# Altium project 211105 Precharge Controller R4b.PrjPcb
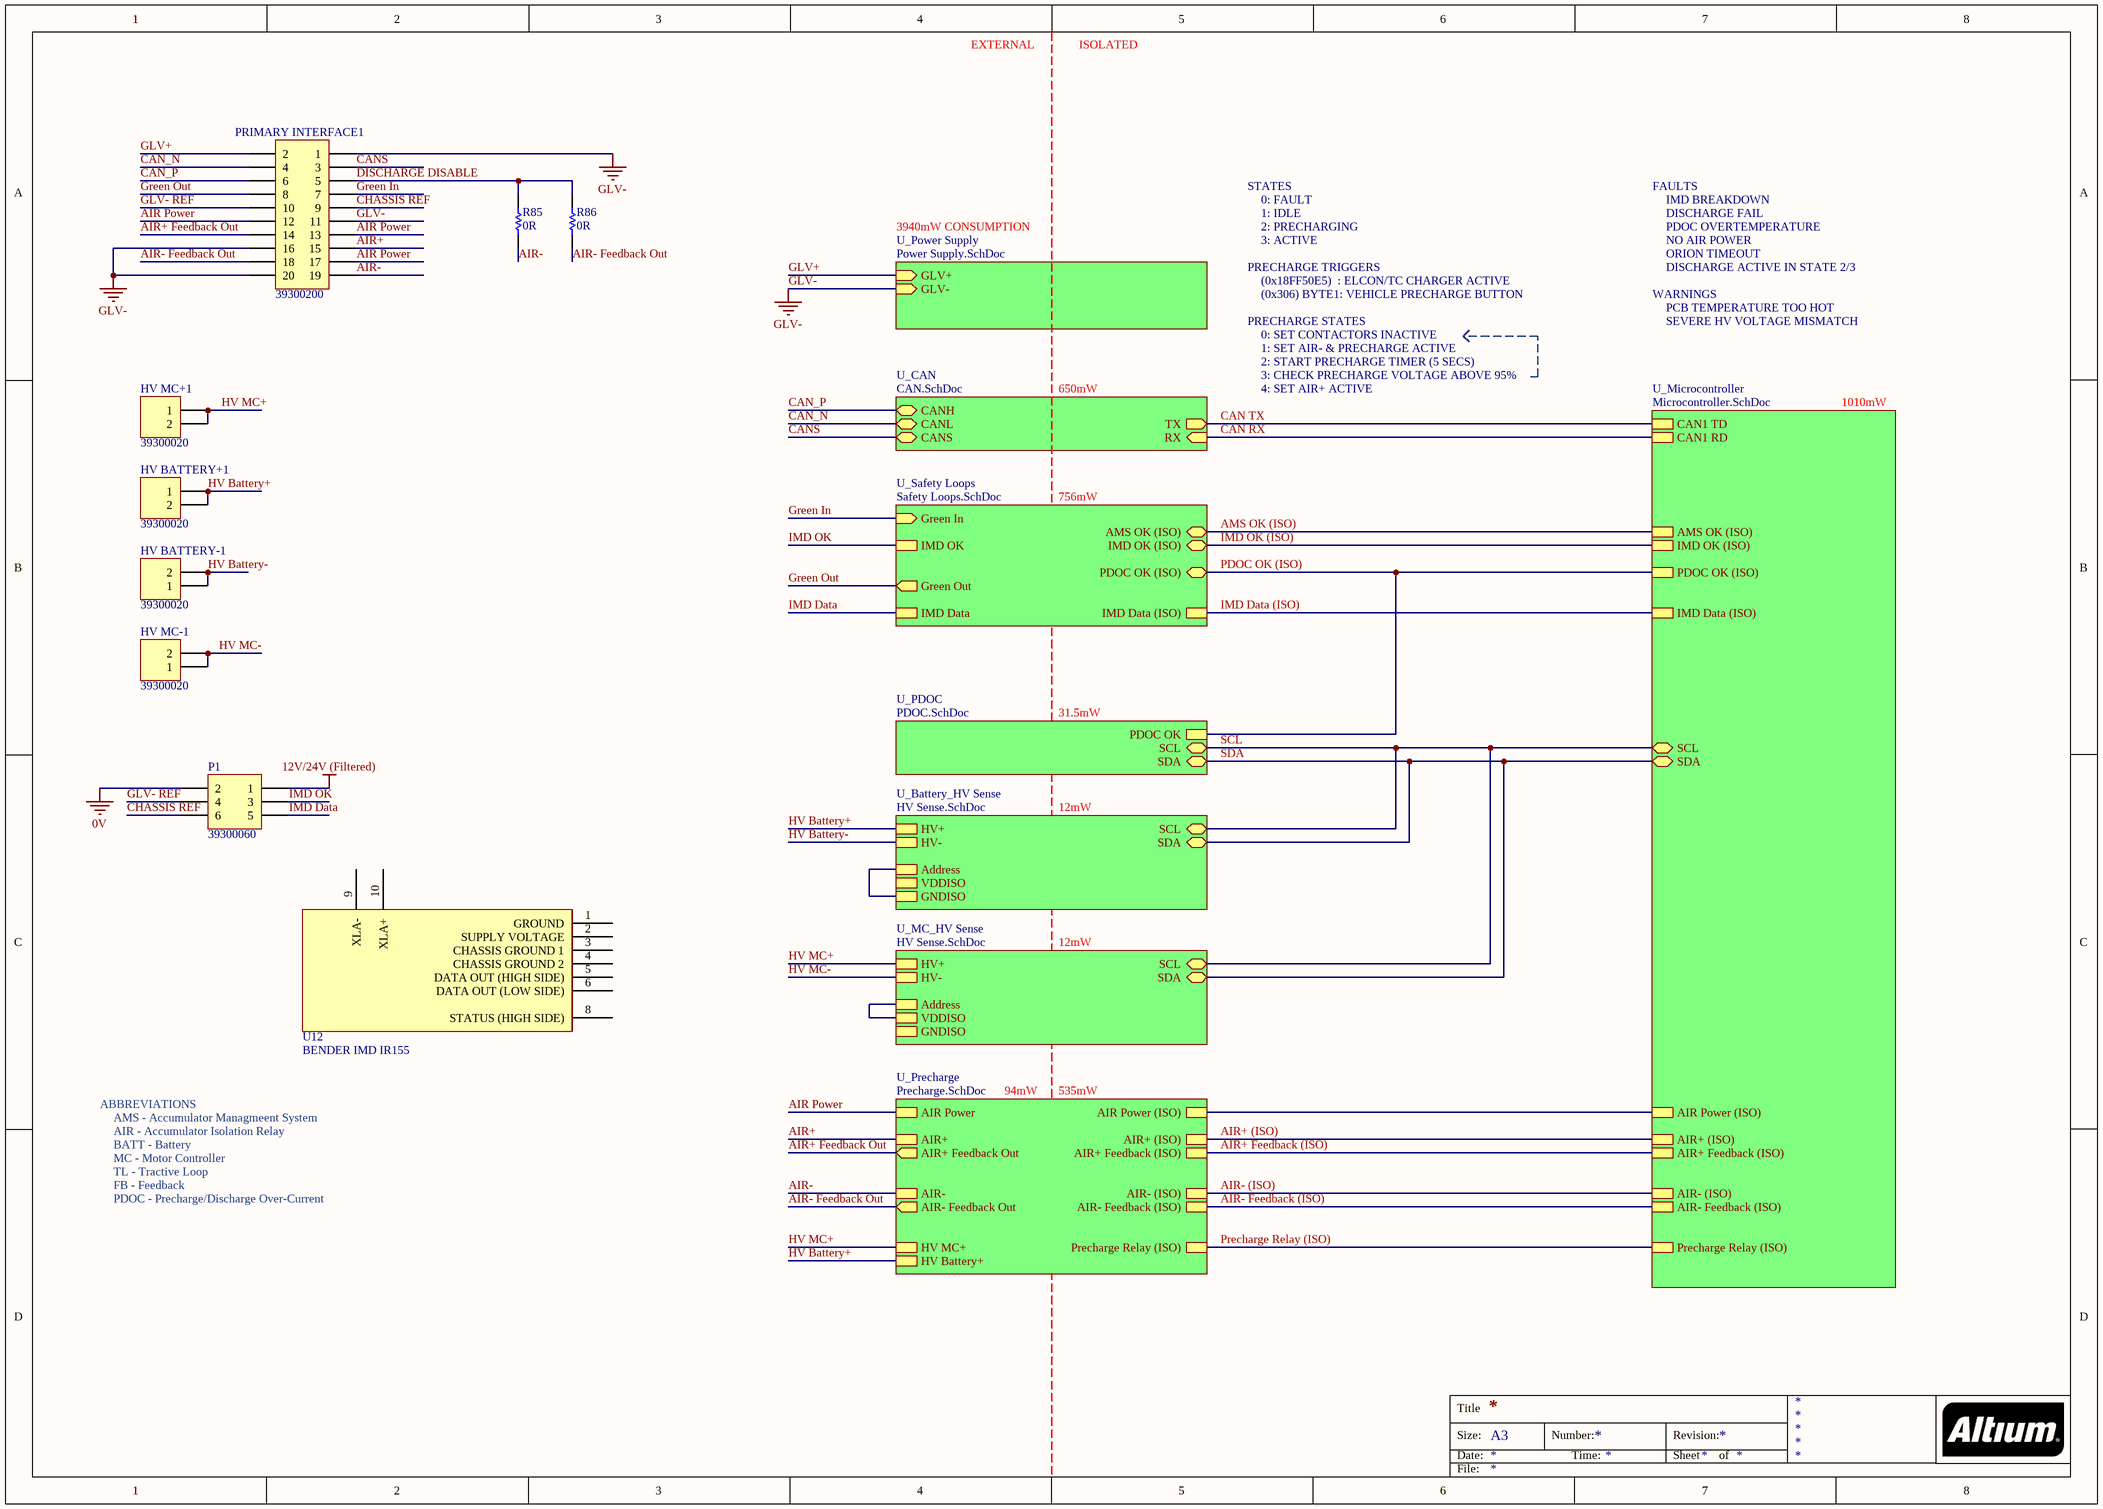
[diagram p0: Top Level.SchDoc]
6 sheets, 216 parts. Net scope: hierarchical (ports join the sheet entries above them; power ports are global).
Board file: Copy of 211105 PCB.PcbDoc
Sheets:
  Top Level.SchDoc
    U_CAN = CAN.SchDoc
    U_Power Supply = Power Supply.SchDoc
    U_Precharge = Precharge.SchDoc
    U_Microcontroller = Microcontroller.SchDoc
    U_Safety Loops = Safety Loops.SchDoc

## Sheet Top Level.SchDoc
size A3

### Parts
HV_BATTERY+1  39300020  [39300020]
HV_BATTERY-1  39300020  [39300020]
HV_MC+1  39300020  [39300020]
HV_MC-1  39300020  [39300020]
P1  39300060  [39300060]
PRIMARY_INTERFACE1  39300200  [39300200]
R85  0R  [0805]
R86  0R  [0805]
U12  BENDER IMD IR155  [BENDER IMD IR155]

### Sub-sheets
U_Battery_HV Sense = HV Sense.SchDoc (file not in this document): HV+, HV-, SCL (bidir), SDA (bidir), Address, VDDISO, GNDISO
U_CAN = CAN.SchDoc: CANH (bidir), CANL (bidir), CANS (bidir), RX (in), TX (out)
U_MC_HV Sense = HV Sense.SchDoc (file not in this document): HV+, HV-, SCL (bidir), SDA (bidir), Address, VDDISO, GNDISO
U_Microcontroller = Microcontroller.SchDoc: AIR- Feedback (ISO), AIR+ Feedback (ISO), AIR- (ISO), Precharge Relay (ISO), AIR+ (ISO), CAN1 TD, CAN1 RD, AIR Power (ISO), IMD OK (ISO), PDOC OK (ISO), AMS OK (ISO), IMD Data (ISO), SCL (bidir), SDA (bidir)
U_PDOC = PDOC.SchDoc (file not in this document): PDOC OK, SCL (bidir), SDA (bidir)
U_Power Supply = Power Supply.SchDoc: GLV+ (in), GLV- (in)
U_Precharge = Precharge.SchDoc: AIR Power, AIR- (ISO), AIR- Feedback Out (out), AIR- Feedback (ISO), AIR-, AIR+, AIR+ Feedback Out (out), AIR+ (ISO), AIR+ Feedback (ISO), Precharge Relay (ISO), HV MC+, HV Battery+, AIR Power (ISO)
U_Safety Loops = Safety Loops.SchDoc: IMD OK (ISO) (bidir), AMS OK (ISO) (bidir), PDOC OK (ISO) (bidir), Green In (in), IMD OK, Green Out (out), IMD Data, IMD Data (ISO)

### Nets
0V: P1.2
12V/24V (Filtered): P1.1
AIR Power: PRIMARY_INTERFACE1.12 PRIMARY_INTERFACE1.13 PRIMARY_INTERFACE1.17 ; sheet U_Precharge/AIR Power
GLV-: PRIMARY_INTERFACE1.1 PRIMARY_INTERFACE1.11 PRIMARY_INTERFACE1.16 PRIMARY_INTERFACE1.20 ; sheet U_Power Supply/GLV-
AIR+: PRIMARY_INTERFACE1.15 ; sheet U_Precharge/AIR+
AIR+ (ISO): sheet U_Precharge/AIR+ (ISO), sheet U_Microcontroller/AIR+ (ISO)
AIR+ Feedback (ISO): sheet U_Precharge/AIR+ Feedback (ISO), sheet U_Microcontroller/AIR+ Feedback (ISO)
AIR+ Feedback Out: PRIMARY_INTERFACE1.14 ; sheet U_Precharge/AIR+ Feedback Out
AIR-: PRIMARY_INTERFACE1.19 R85.1 ; sheet U_Precharge/AIR-
AIR- (ISO): sheet U_Precharge/AIR- (ISO), sheet U_Microcontroller/AIR- (ISO)
AIR- Feedback (ISO): sheet U_Precharge/AIR- Feedback (ISO), sheet U_Microcontroller/AIR- Feedback (ISO)
AIR- Feedback Out: PRIMARY_INTERFACE1.18 R86.1 ; sheet U_Precharge/AIR- Feedback Out
AMS OK (ISO): sheet U_Microcontroller/AMS OK (ISO), sheet U_Safety Loops/AMS OK (ISO)
CAN RX: sheet U_CAN/RX, sheet U_Microcontroller/CAN1 RD
CAN TX: sheet U_CAN/TX, sheet U_Microcontroller/CAN1 TD
CAN_N: PRIMARY_INTERFACE1.4 ; sheet U_CAN/CANL
CAN_P: PRIMARY_INTERFACE1.6 ; sheet U_CAN/CANH
CANS: PRIMARY_INTERFACE1.3 ; sheet U_CAN/CANS
CHASSIS REF: P1.6 PRIMARY_INTERFACE1.9
DISCHARGE DISABLE: PRIMARY_INTERFACE1.5 R85.2 R86.2
GLV+: PRIMARY_INTERFACE1.2 ; sheet U_Power Supply/GLV+
GLV- REF: P1.4 PRIMARY_INTERFACE1.10
Green In: PRIMARY_INTERFACE1.7 ; sheet U_Safety Loops/Green In
Green Out: PRIMARY_INTERFACE1.8 ; sheet U_Safety Loops/Green Out
HV Battery+: HV_BATTERY+1.1 HV_BATTERY+1.2 ; sheet U_Precharge/HV Battery+, sheet U_Battery_HV Sense/HV+
HV Battery-: HV_BATTERY-1.1 HV_BATTERY-1.2 ; sheet U_Battery_HV Sense/HV-
HV MC+: HV_MC+1.1 HV_MC+1.2 ; sheet U_Precharge/HV MC+, sheet U_MC_HV Sense/HV+
HV MC-: HV_MC-1.1 HV_MC-1.2 ; sheet U_MC_HV Sense/HV-
IMD Data: P1.5 ; sheet U_Safety Loops/IMD Data
IMD Data (ISO): sheet U_Microcontroller/IMD Data (ISO), sheet U_Safety Loops/IMD Data (ISO)
IMD OK: P1.3 ; sheet U_Safety Loops/IMD OK
IMD OK (ISO): sheet U_Microcontroller/IMD OK (ISO), sheet U_Safety Loops/IMD OK (ISO)
PDOC OK (ISO): sheet U_Microcontroller/PDOC OK (ISO), sheet U_Safety Loops/PDOC OK (ISO), sheet U_PDOC/PDOC OK
Precharge Relay (ISO): sheet U_Precharge/Precharge Relay (ISO), sheet U_Microcontroller/Precharge Relay (ISO)
SCL: sheet U_Microcontroller/SCL, sheet U_Battery_HV Sense/SCL, sheet U_MC_HV Sense/SCL, sheet U_PDOC/SCL
SDA: sheet U_Microcontroller/SDA, sheet U_Battery_HV Sense/SDA, sheet U_MC_HV Sense/SDA, sheet U_PDOC/SDA
NetR5_1: sheet U_Precharge/AIR Power (ISO), sheet U_Microcontroller/AIR Power (ISO)
(unnamed): sheet U_Battery_HV Sense/Address, sheet U_Battery_HV Sense/GNDISO
(unnamed): sheet U_MC_HV Sense/Address, sheet U_MC_HV Sense/VDDISO

Not connected (* = marked no-connect by the designer): U12 1(GROUND) 2(SUPPLY_VOLTAGE) 3(CHASSIS_GROUND_1) 4(CHASSIS_GROUND_2) 5(DATA_OUT_(HIGH_SIDE)) 6(DATA_OUT_(LOW_SIDE)) 8(STATUS_(HIGH_SIDE)) 9(XLA-) 10(XLA+)

### Notes on the sheet
- EXTERNAL
- ISOLATED
- 3940mW CONSUMPTION
- STATES
- 0: FAULT
- 1: IDLE
- 2: PRECHARGING
- 3: ACTIVE
- FAULTS
- IMD BREAKDOWN
- DISCHARGE FAIL
- PDOC OVERTEMPERATURE
- NO AIR POWER
- PRECHARGE TRIGGERS
- (0x18FF50E5)  : ELCON/TC CHARGER ACTIVE
- (0x306) BYTE1: VEHICLE PRECHARGE BUTTON
- WARNINGS
- PCB TEMPERATURE TOO HOT
- ORION TIMEOUT
- DISCHARGE ACTIVE IN STATE 2/3
- PRECHARGE STATES
- 1: SET AIR- & PRECHARGE ACTIVE
- 2: START PRECHARGE TIMER (5 SECS)
- 3: CHECK PRECHARGE VOLTAGE ABOVE 95%
- 0: SET CONTACTORS INACTIVE
- SEVERE HV VOLTAGE MISMATCH
- 650mW
- 4: SET AIR+ ACTIVE
- 1010mW
- 756mW
- 31.5mW
- 12mW
- ABBREVIATIONS
- AMS - Accumulator Managmeent System
- 94mW
- 535mW
- TL - Tractive Loop
- FB - Feedback
- BATT - Battery
- MC - Motor Controller
- AIR - Accumulator Isolation Relay
- PDOC - Precharge/Discharge Over-Current
- Title
- Size:
- Date:
- A3
- Number:
- Time:
- Revision:
- Sheet
- of
- File:

### Library data of the parts
HV_BATTERY+1 HV_BATTERY-1 HV_MC+1 HV_MC-1 = 39300020: Pitch: 4.2mm; Row Spacing: 5.5mm; Angle: 90; Flange: No; Contact: Tin; Part Number: 39300020; Positions: 2; Digikey Part Number: WM21351-ND
P1 = 39300060: Pitch: 4.2mm; Row Spacing: 5.5mm; Angle: 90; Flange: No; Contact: Tin; Part Number: 39300060; Positions: 6; Digikey Part Number: WM21353-ND
PRIMARY_INTERFACE1 = 39300200: Pitch: 4.2mm; Row Spacing: 5.5mm; Angle: 90; Flange: No; Contact: Tin; Part Number: 39300200; Positions: 20; Digikey Part Number: WM21360-ND
R85 R86 = RC0805FR070RL: Manufacturer: YAGEO; Tolerance: 0.01; Rated Voltage: 0.125W; Part Number: RC0805FR070RL; Value: 0R; Material: FR-07; Digikey Part Number: 311-0.0CRCT-ND
U12 = BENDER IMD IR155: Insulation monitoring device (IMD) for unearthed DC drive systems (IT systems) in electric vehicles.; Part Number: BENDER IMD IR155; Manufacturer: Bender; Link: https://www.bender.de/en/products/insulation-monitoring/isometer_ir155-3203ir155-3204

## Sheet CAN.SchDoc
size A4
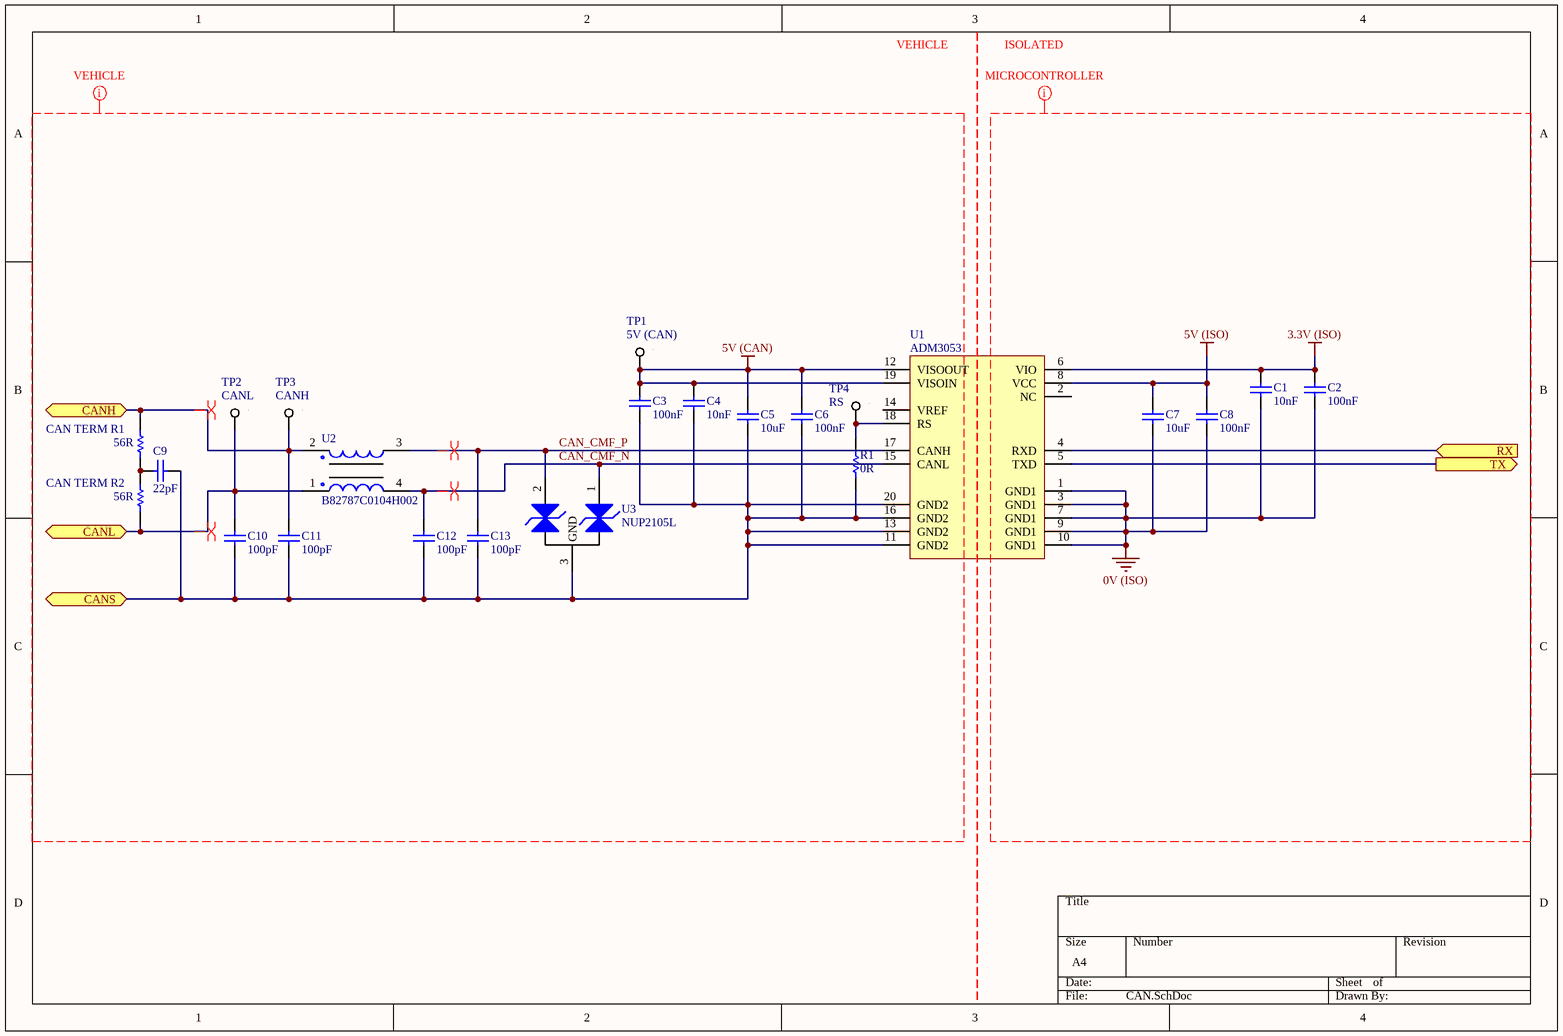
[diagram p1: CAN.SchDoc]

### Parts
C1  10nF  [1206]
C2  100nF  [0805]
C3  100nF  [0805]
C4  10nF  [1206]
C5  10uF  [0805]
C6  100nF  [0805]
C7  10uF  [0805]
C8  100nF  [0805]
C9  22pF  [0805]
C10  100pF  [0805]
C11  100pF  [0805]
C12  100pF  [0805]
C13  100pF  [0805]
CAN_TERM_R1  56R  [0805]
CAN_TERM_R2  56R  [0805]
R1  0R  [0805]
TP1  5V (CAN)  [SMD Test Point 1mm]
TP2  CANL  [SMD Test Point 1mm]
TP3  CANH  [SMD Test Point 1mm]
TP4  RS  [SMD Test Point 1mm]
U1  ADM3053  [AD SOIC-W 20]
U2  B82787C0104H002  [TDK 4-PC Pad]
U3  NUP2105L  [ON SOT-23]

### Ports
CANH (bidir), CANL (bidir), CANS (bidir), RX (in), TX (out)

### Nets
0V (ISO): C1.1 C2.1 C7.1 C8.1 U1.1(GND1) U1.3(GND1) U1.7(GND1) U1.9(GND1) U1.10(GND1)
3.3V (ISO): C1.2 C2.2 U1.6(VIO)
5V (CAN): C3.2 C4.2 C5.2 C6.2 TP1.1 U1.12(VISOOUT) U1.19(VISOIN)
5V (ISO): C7.2 C8.2 U1.8(VCC)
CAN RX: U1.4(RXD) ; port RX
CAN TX: U1.5(TXD) ; port TX
CAN_CMF_N: C12.2 U1.15(CANL) U2.4 U3.1(CAN_H)
CAN_CMF_P: C13.2 U1.17(CANH) U2.3 U3.2(CAN_L)
CAN_N: C10.2 CAN_TERM_R2.1 TP2.1 U2.1 ; port CANL
CAN_P: C11.2 CAN_TERM_R1.2 TP3.1 U2.2 ; port CANH
CANS: C3.1 C4.1 C5.1 C6.1 C9.1 C10.1 C11.1 C12.1 C13.1 R1.1 U1.11(GND2) U1.13(GND2) U1.16(GND2) U1.20(GND2) U3.3(GND) ; port CANS
NetC9_2: C9.2 CAN_TERM_R1.1 CAN_TERM_R2.2
NetR1_2: R1.2 TP4.1 U1.18(RS)

Not connected (* = marked no-connect by the designer): U1 2(NC) 14(VREF)

### Layout directives
differential pair; differential pair class CAN_IN: CAN_CMF_N, CAN_CMF_P, CAN_N, CAN_P
net class VEHICLE: 5V (CAN), CAN_CMF_N, CAN_CMF_P
net class MICROCONTROLLER: 0V (ISO), 3.3V (ISO), 5V (ISO)

### Notes on the sheet
- VEHICLE
- ISOLATED

### Library data of the parts
C1 C4 = GCM3195C2A103JA16D: Manufacturer: muRata; Tolerance: 5%; Material: Ceramic; Rated Voltage: 100V; Part Number: GCM3195C2A103JA16D; Value: 10nF; Digikey Part Number: 490-4978-2-ND
C2 C3 C6 C8 = GCM21BR71H104KA37L: Manufacturer: muRata; Tolerance: ±10%; Material: X7R; Rated Voltage: 50V; Part Number: GCM21BR71H104KA37L; Value: 100nF; Digikey Part Number: 490-6064-1-ND
C5 C7 = GRM21BR6YA106KE43L: Manufacturer: muRata; Tolerance: 10%; Material: X5R; Rated Voltage: 50V; Part Number: GRM21BR6YA106KE43L; Value: 10uF; Digikey Part Number: 490-10514-6-ND
C9 = GRM21A5C2E220JW01D: Manufacturer: muRata; Tolerance: ±5%; Material: C0G, NP0; Rated Voltage: 250V; Part Number: GRM21A5C2E220JW01D; Value: 22pF; Digikey Part Number: 490-5534-1-ND
C10-C13 = GCM2165C1H101JA16D: Manufacturer: muRata; Tolerance: ±5%; Material: C0G, NP0; Rated Voltage: 50V; Part Number: GCM2165C1H101JA16D; Value: 100pF; Digikey Part Number: 490-8031-1-ND
CAN_TERM_R1 CAN_TERM_R2 = RC0805FR0756RL: Manufacturer: YAGEO; Tolerance: 0.01; Rated Voltage: 0.125W; Part Number: RC0805FR0756RL; Value: 56R; Material: FR-07; Digikey Part Number: 311-56.0CRCT-ND
R1 = RC0805FR070RL: as R85 on sheet Top Level; Part Number: RC0805FR070RL; Value: 0R; Material: FR-07; Digikey Part Number: 311-0.0CRCT-ND
TP1-TP4 = SMD Test Point Small: Positions: 1; Pitch: 0mm; Row Spacing: 0; Flange: No; Contact: NA; Part Number: SMD Test Point Small; Angle: 0
U1 = ADM3053: Isolated CAN Transceiver; Manufacturer: Analogue Devices; Part Number: ADM3053; Digikey Part Number: ADM3053BRWZ-ND; Digikey Link: https://www.digikey.com/product-detail/en/analog-devices-inc/ADM3053BRWZ/ADM3053BRWZ-ND/2709332
U2 = B82787C0104H002: 100µH @ 100kHz 2 Line Common Mode Choke Surface Mount 5.8 kOhms @ 10MHz 150mA DCR 2Ohm; Manufacturer: EPCOS (TDK); Part Number: B82787C0104H002; Impedence: 5.8 kOhms @ 10MHz; Material: Wirewound; Rated Current: 150mA; Digikey Part Number: 495-4598-1-ND; Digikey Link: https://www.digikey.com/product-detail/en/epcos-tdk/B82787C0104H002/495-4598-2-ND/3680998; Value: 100µH @ 100kHz
U3 = NUP2105L: Dual Line CAN Bus Protector; Manufacturer: ON Semiconductor; Part Number: NUP2105L; Digikey Part Number: NUP2105LT1GOSCT-ND; Digikey Link: https://www.digikey.com/product-detail/en/on-semiconductor/NUP2105LT1G/NUP2105LT1GOSCT-ND/1485001

## Sheet Power Supply.SchDoc
size A4
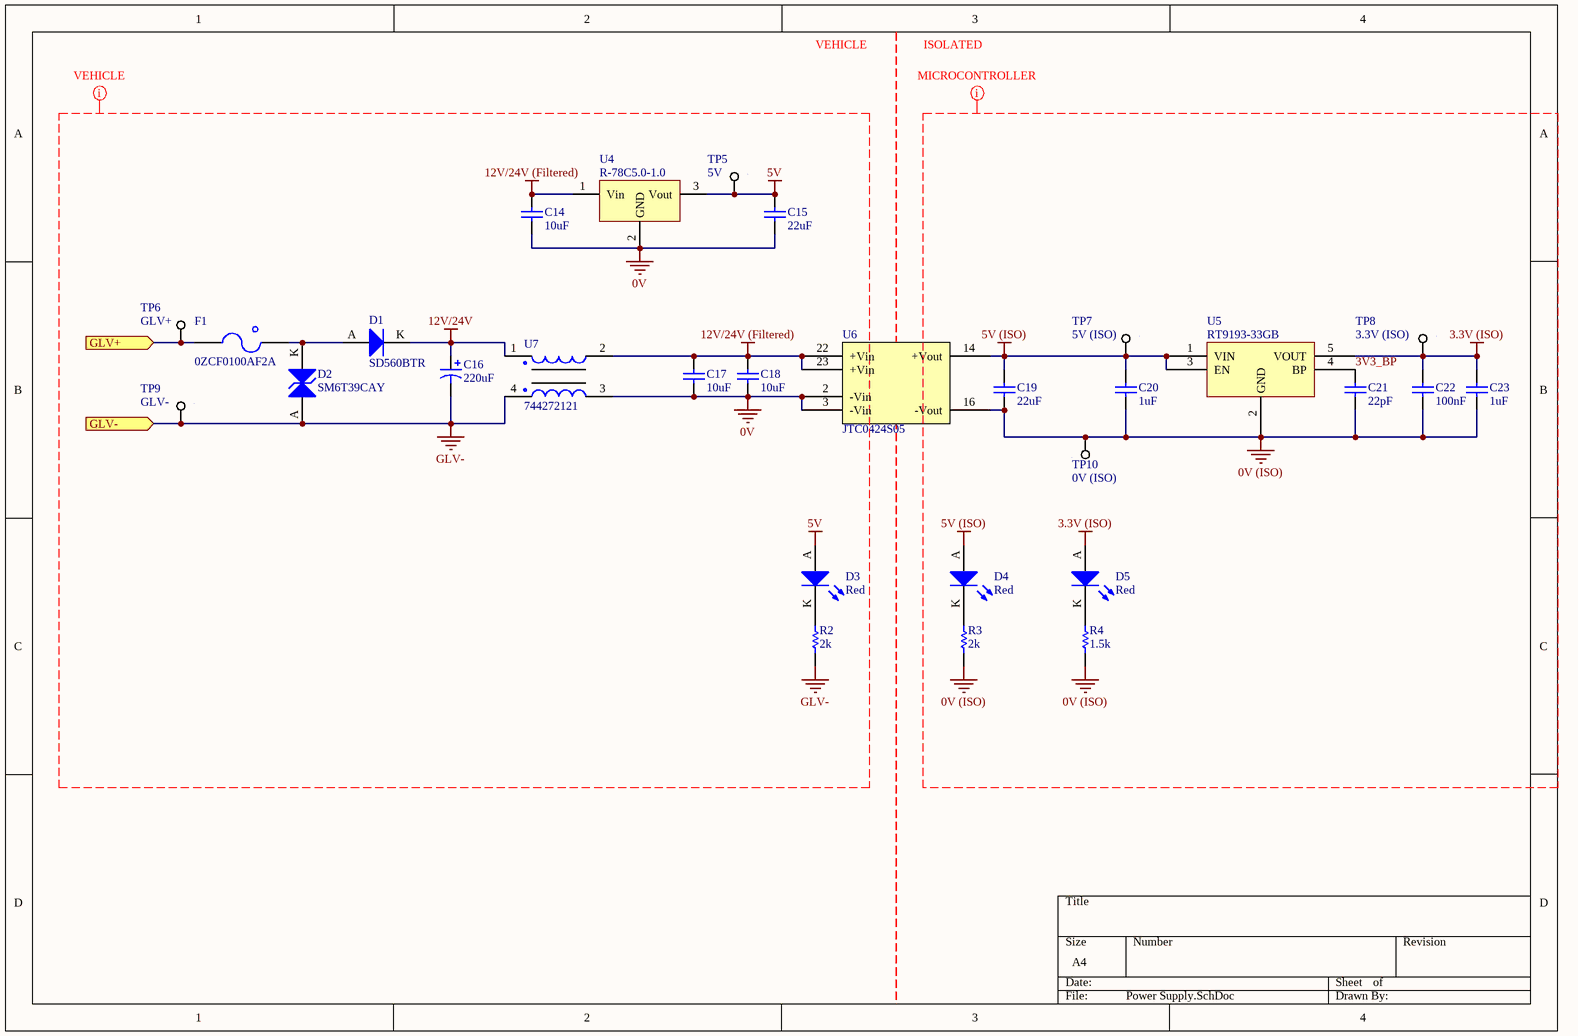
[diagram p2: Power Supply.SchDoc]

### Parts
C14  10uF  [0805]
C15  22uF  [1206]
C16  220uF  [Vishay Radial 1213]
C17  10uF  [0805]
C18  10uF  [0805]
C19  22uF  [1206]
C20  1uF  [0805]
C21  22pF  [0805]
C22  100nF  [0805]
C23  1uF  [0805]
D1  SD560BTR  [SMB Diode]
D2  SM6T39CAY  [ST SMB Diode]
D3  Red  [0805 LED]
D4  Red  [0805 LED]
D5  Red  [0805 LED]
F1  0ZCF0100AF2A  [2920]
R2  2k  [0805]
R3  2k  [0805]
R4  1.5k  [0805]
TP5  5V  [SMD Test Point 1mm]
TP6  GLV+  [SMD Test Point 1mm]
TP7  5V (ISO)  [SMD Test Point 1mm]
TP8  3.3V (ISO)  [SMD Test Point 1mm]
TP9  GLV-  [SMD Test Point 1mm]
TP10  0V (ISO)  [SMD Test Point 1mm]
U4  R-78C5.0-1.0  [RECOM 3-SIP]
U5  RT9193-33GB  [RICHTEK SOT-23-5]
U6  JTC0424S05  [24-DIP Module, 7 Leads]
U7  744272121  [Wurth 4-PC Pad]

### Ports
GLV+ (in), GLV- (in)

### Nets
0V: C14.1 C15.1 C17.1 C18.1 U4.2(GND) U6.2(-Vin) U6.3(-Vin) U7.3
0V (ISO): C19.1 C20.1 C21.1 C22.1 C23.1 R3.1 R4.1 TP10.1 U5.2(GND) U6.16(-Vout)
3.3V (ISO): C22.2 C23.2 D5.A TP8.1 U5.5(VOUT)
5V: C15.2 D3.A TP5.1 U4.3(Vout)
5V (ISO): C19.2 C20.2 D4.A TP7.1 U5.1(VIN) U5.3(EN) U6.14(+Vout)
12V/24V: C16.2 D1.K U7.1
12V/24V (Filtered): C14.2 C17.2 C18.2 U4.1(Vin) U6.22(+Vin) U6.23(+Vin) U7.2
GLV-: C16.1 D2.A R2.1 TP9.1 U7.4 ; port GLV-
3V3_BP: C21.2 U5.4(BP)
GLV+: F1.1 TP6.1 ; port GLV+
NetD1_A: D1.A D2.K F1.2
NetD3_K: D3.K R2.2
NetD4_K: D4.K R3.2
NetD5_K: D5.K R4.2

### Layout directives
net class VEHICLE: 0V, 5V, 12V/24V, 12V/24V (Filtered), GLV-
net class MICROCONTROLLER: 0V (ISO), 3.3V (ISO), 3V3_BP, 5V (ISO)

### Notes on the sheet
- VEHICLE
- ISOLATED

### Library data of the parts
C14 C17 C18 = GRM21BR6YA106KE43L: as C5 on sheet CAN; Part Number: GRM21BR6YA106KE43L; Value: 10uF; Digikey Part Number: 490-10514-6-ND
C15 C19 = CC1206MKX5R7BB226: Manufacturer: YAGEO; Tolerance: 20%; Material: Ceramic; Rated Voltage: 16V; Part Number: CC1206MKX5R7BB226; Value: 22uF; Digikey Part Number: 311-1997-2-ND
C16 = MAL214699106E3: Manufacturer: Vishay; Tolerance: 20%; Material: Aluminium Electrolytic; Rated Voltage: 50V; Part Number: MAL214699106E3; Value: 220uF; Digikey Part Number: 4440PHCT-ND
C20 C23 = AC0805KKX7R8BB105: Manufacturer: YAGEO; Tolerance: 10%; Material: X7R; Rated Voltage: 25V; Part Number: AC0805KKX7R8BB105; Value: 1uF; Digikey Part Number: DO NOT USE FOR NEW DESIGNS
C21 = GRM21A5C2E220JW01D: as C9 on sheet CAN; Part Number: GRM21A5C2E220JW01D; Value: 22pF; Digikey Part Number: 490-5534-1-ND
C22 = GCM21BR71H104KA37L: as C2 on sheet CAN; Part Number: GCM21BR71H104KA37L; Value: 100nF; Digikey Part Number: 490-6064-1-ND
D1 = SD560BTR: 1.2V_F 600V 5A SMB; Manufacturer: SMC Diode Solutions; Part Number: SD560BTR; Digikey Part Number: 1655-1530-2-ND; Digikey Link: https://www.digikey.com/product-detail/en/smc-diode-solutions/SD560BTR/1655-1530-2-ND/6022620
D2 = SM6T39CAY: 42.8V Clamp 93A (8/20µs) Ipp Tvs Diode Surface Mount SMB (DO-214AA); Manufacturer: ST; Vf: 42.8; Part Number: SM6T39CAY; Vbr: 42.8V; Digikey Part Number: SM6T39CAY; Digikey Link: https://www.digikey.com/en/products/detail/stmicroelectronics/SM6T39CAY/2442903; Alternative Parts: https://www.digikey.com/en/products/detail/stmicroelectronics/SM6T39AY/2442901
D3-D5 = SML-210LTT86: Red LED Indication - Discrete 1.75V 0805 (2012 Metric); Manufacturer: ROHM Semiconductor; Part Number: SML-210LTT86; Colour: Red; Digikey Part Number: 511-1286-1-ND; Digikey Link: https://www.digikey.com/product-detail/en/rohm-semiconductor/SML-210LTT86/511-1286-1-ND/637099
F1 = 0ZCF0100AF2A: PTC RESET FUSE 60V 1A 292; Manufacturer: Littelfuse Inc.; Part Number: 0ZCF0100AF2A; Digikey Part Number: 507-2070-1-ND; Digikey Link: https://www.digikey.com/product-detail/en/bel-fuse-inc/0ZCF0100AF2A/507-2070-1-ND/6210547
R2 R3 = RC0805FR072KL: Manufacturer: YAGEO; Tolerance: 0.01; Rated Voltage: 0.125W; Part Number: RC0805FR072KL; Value: 2k; Material: FR-07; Digikey Part Number: 311-2.00KCRCT-ND
R4 = RC0805FR071K5L: Manufacturer: YAGEO; Tolerance: 0.01; Rated Voltage: 0.125W; Part Number: RC0805FR071K5L; Value: 1.5k; Material: FR-07; Digikey Part Number: 311-1.50KCRCT-ND
TP5-TP10 = SMD Test Point Small: as TP1 on sheet CAN; Part Number: SMD Test Point Small; Angle: 0
U4 = R-78C5.0-1.0: CONV DC/DC 1A 5V OUT SIP VERT; Manufacturer: Recom; Isolation: Non-Isolated; Output Power: 5W; Part Number: R-78C5.0-1.0; Digikey Part Number: 945-1395-5-ND; Digikey Link: https://www.digikey.com.au/product-detail/en/recom-power/R-78C5.0-1.0/945-1395-5-ND/2652148; Output Voltage: 5V
U5 = RT9193-33GB: Linear Voltage Regulator IC 1 Output 300mA SOT-23-5; Manufacturer: Richtek; Input Voltage: 5.5V-0.3V; Output Voltage: 3.3V; Output Power: 1W; Efficiency: 0.5; Isolation: Non-Isolated; Part Number: RT9193-33GB; Digikey Part Number: 1028-1014-1-ND; Digikey Link: https://www.digikey.com/products/en?keywords=1028-1014-1-ND
U6 = JTC0424S05: DC DC CONVERTER 5V 4W; Manufacturer: XP Power; Input Voltage: 9V-36V; Efficiency: 0.79; Isolation: Isolated; Part Number: JTC0424S05; Output Voltage: 5V; Output Power: 4W; Digikey Part Number: JTC0424S05-ND; Digikey Link: https://www.digikey.com/products/en?keywords=%20JTC0424S05
U7 = 744272121: 120µH @ 100kHz 2 Line Common Mode Choke Surface Mount 460 Ohms @ 30MHz 2.5A DCR 25mOhm; Manufacturer: Wurth Electronics Inc; Value: 120uH @ 100kHz; Part Number: 744272121; Impedence: 460 Ohms @ 30MHz; Material: Wirewound; Rated Current: 2.5A; Digikey Part Number: 732-1489-1-ND; Digikey Link: https://www.digikey.com/product-detail/en/w-rth-elektronik/744272121/732-1489-1-ND/1639501

## Sheet Precharge.SchDoc
size A3
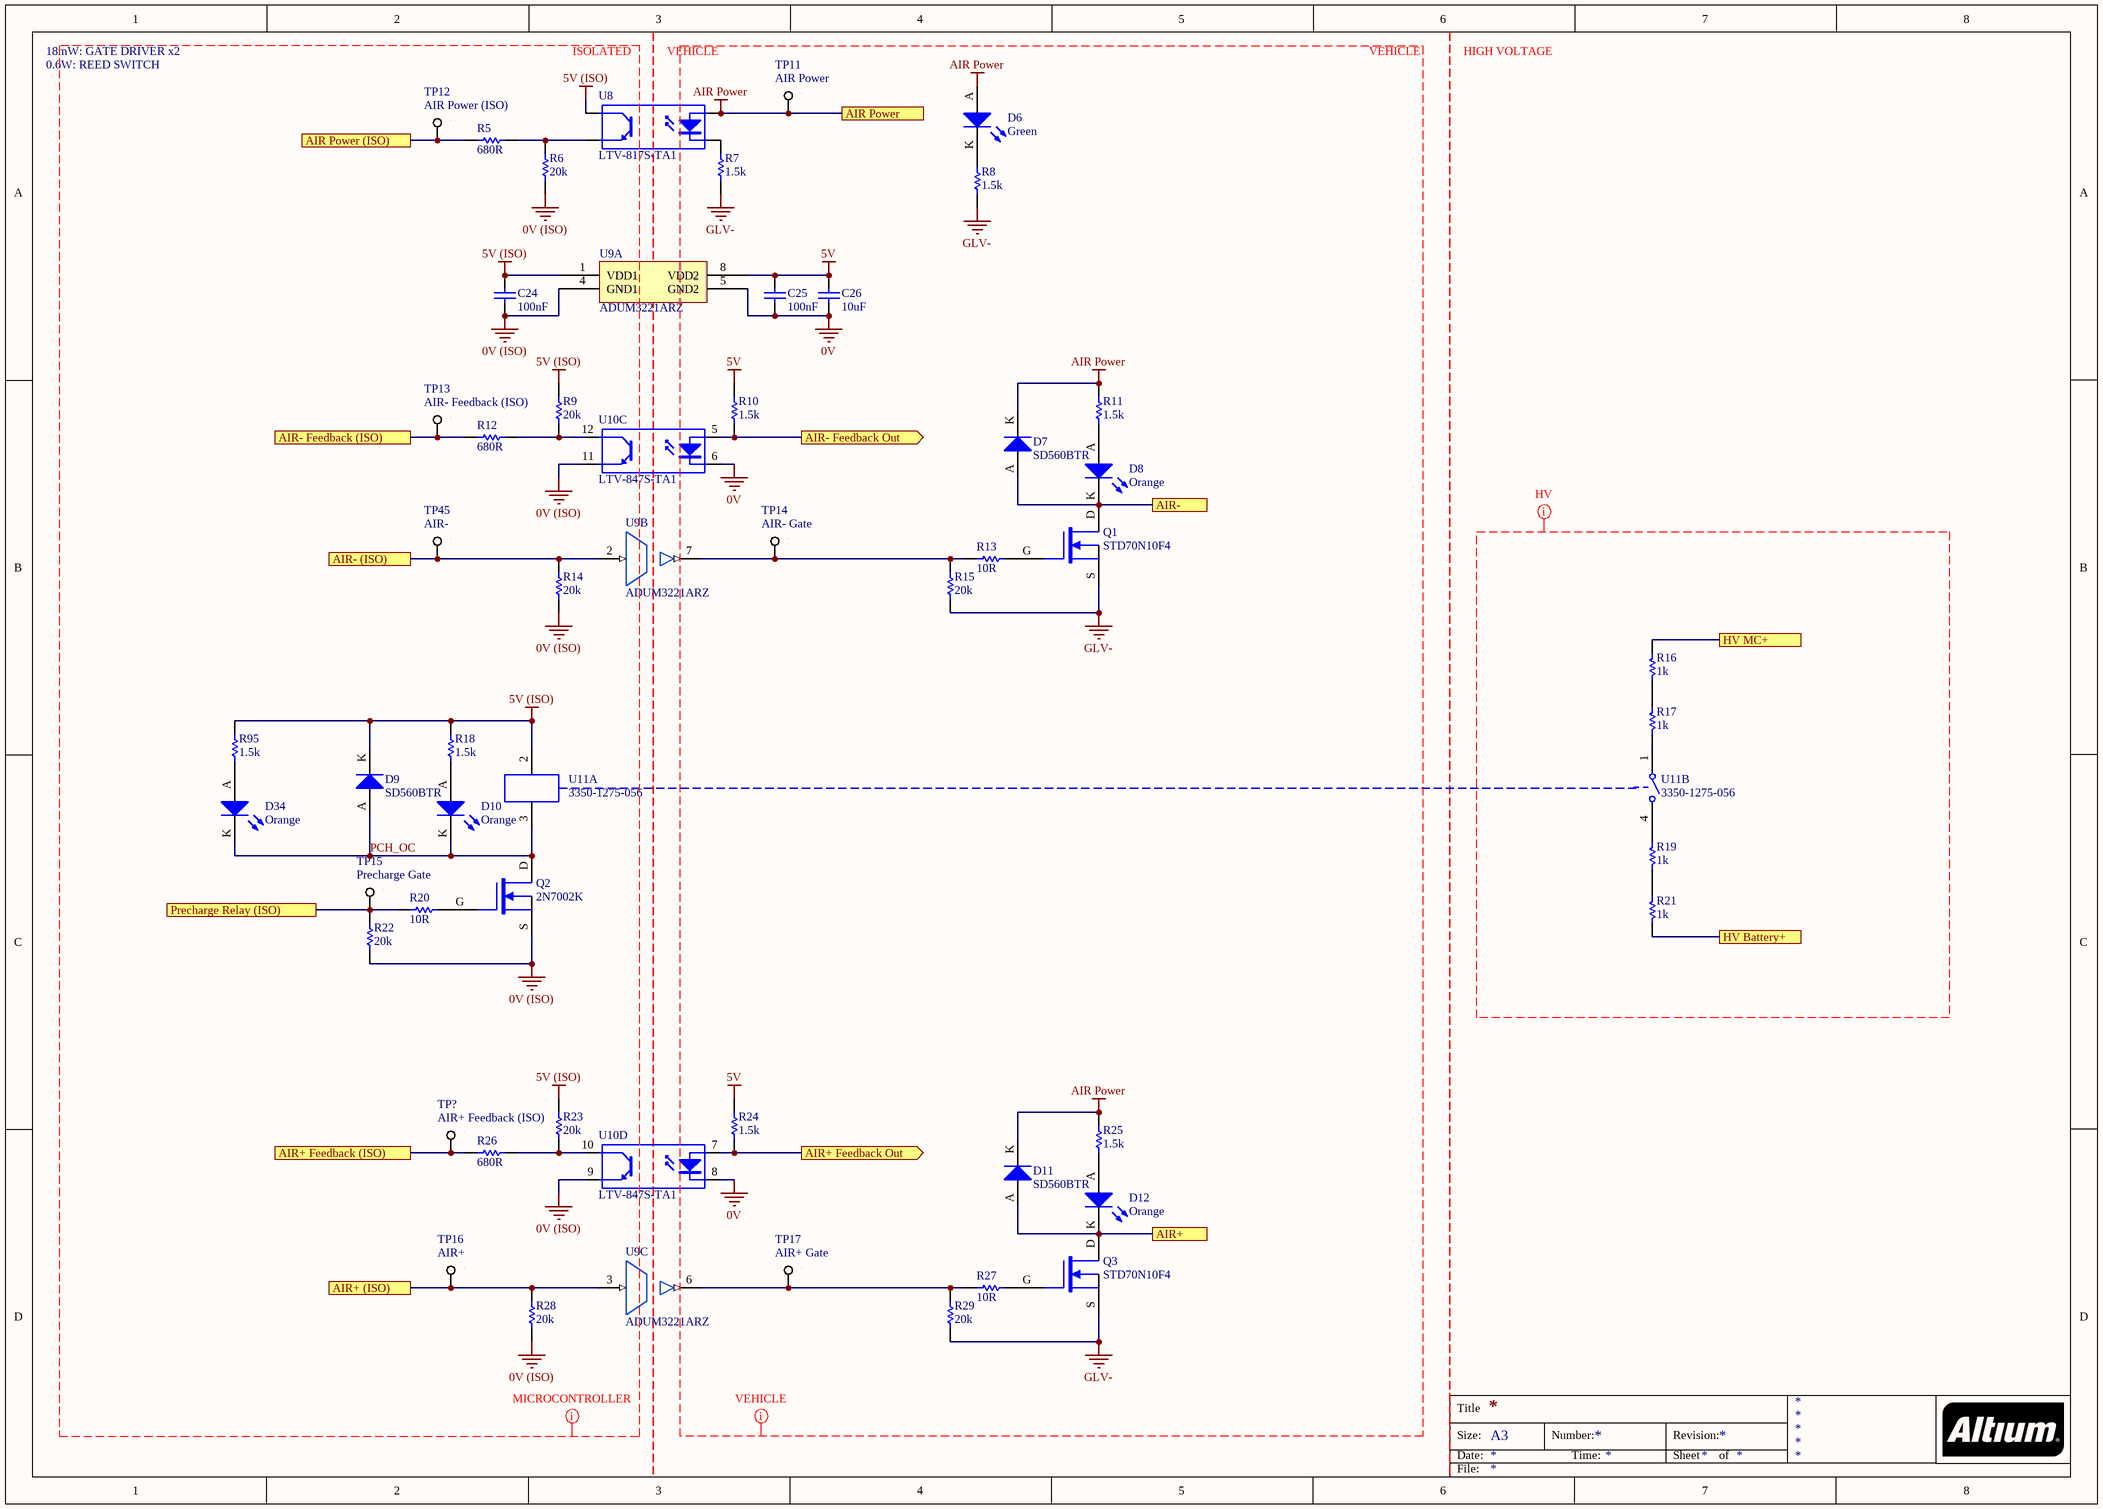
[diagram p3: Precharge.SchDoc]

### Parts
C24  100nF  [0805]
C25  100nF  [0805]
C26  10uF  [0805]
D6  Green  [0805 LED]
D7  SD560BTR  [SMB Diode]
D8  Orange  [0805 LED]
D9  SD560BTR  [SMB Diode]
D10  Orange  [0805 LED]
D11  SD560BTR  [SMB Diode]
D12  Orange  [0805 LED]
D34  Orange  [0805 LED]
Q1  STD70N10F4  [STM TO-252 MOSFET]
Q2  2N7002K  [ON SOT-23 MOSFET]
Q3  STD70N10F4  [STM TO-252 MOSFET]
R5  680R  [0805]
R6  20k  [0805]
R7  1.5k  [0805]
R8  1.5k  [0805]
R9  20k  [0805]
R10  1.5k  [0805]
R11  1.5k  [0805]
R12  680R  [0805]
R13  10R  [0805]
R14  20k  [0805]
R15  20k  [0805]
R16  1k  [B TO-263]
R17  1k  [B TO-263]
R18  1.5k  [0805]
R19  1k  [B TO-263]
R20  10R  [0805]
R21  1k  [B TO-263]
R22  20k  [0805]
R23  20k  [0805]
R24  1.5k  [0805]
R25  1.5k  [0805]
R26  680R  [0805]
R27  10R  [0805]
R28  20k  [0805]
R29  20k  [0805]
R95  1.5k  [0805]
TP11  AIR Power  [SMD Test Point 1mm]
TP12  AIR Power (ISO)  [SMD Test Point 1mm]
TP13  AIR- Feedback (ISO)  [SMD Test Point 1mm]
TP14  AIR- Gate  [SMD Test Point 1mm]
TP15  Precharge Gate  [SMD Test Point 1mm]
TP16  AIR+  [SMD Test Point 1mm]
TP17  AIR+ Gate  [SMD Test Point 1mm]
TP45  AIR-  [SMD Test Point 1mm]
TP?  AIR+ Feedback (ISO)  [SMD Test Point 1mm]
U8  LTV-817S-TA1  [ON 4-SMD]
U9  ADUM3221ARZ  [AD 8-SOIC]  (parts A,B,C of 3)
U10  LTV-847S-TA1  [ON 16-SMD]  (parts C,D of 4)
U11  3350-1275-056  [CI SPST]  (parts A,B of 2)

### Ports
AIR Power, AIR Power (ISO), AIR+, AIR+ (ISO), AIR+ Feedback (ISO), AIR+ Feedback Out (out), AIR-, AIR- (ISO), AIR- Feedback (ISO), AIR- Feedback Out (out), HV Battery+, HV MC+, Precharge Relay (ISO)

### Nets
0V: C25.1 C26.1 U9.5(GND2) U10.6(K) U10.8(K)
0V (ISO): C24.1 Q2.S R6.1 R14.1 R22.1 R28.1 U9.4(GND1) U10.9(E) U10.11(E)
5V: C25.2 C26.2 R10.2 R24.2 U9.8(VDD2)
5V (ISO): C24.2 D9.K R9.2 R18.2 R23.2 R95.2 U8.4(C) U9.1(VDD1) U11.2
AIR Power: D6.A D7.K D11.K R11.2 R25.2 TP11.1 U8.1(A) ; port AIR Power
GLV-: Q1.S Q3.S R7.2 R8.2 R15.1 R29.1
AIR+: D11.A D12.K Q3.D ; port AIR+
AIR+ (ISO): R28.2 TP16.1 U9.3(VIA) ; port AIR+ (ISO)
AIR+ Feedback (ISO): R26.1 TP?.1 ; port AIR+ Feedback (ISO)
AIR+ Feedback Out: R24.1 U10.7(A) ; port AIR+ Feedback Out
AIR-: D7.A D8.K Q1.D ; port AIR-
AIR- (ISO): R14.2 TP45.1 U9.2(VIA) ; port AIR- (ISO)
AIR- Feedback (ISO): R12.1 TP13.1 ; port AIR- Feedback (ISO)
AIR- Feedback Out: R10.1 U10.5(A) ; port AIR- Feedback Out
HV Battery+: R21.1 ; port HV Battery+
HV MC+: R16.2 ; port HV MC+
PCH_OC: D9.A D10.K D34.K Q2.D U11.3
Precharge Relay (ISO): R20.1 R22.2 TP15.1 ; port Precharge Relay (ISO)
NetD6_K: D6.K R8.1
NetD8_A: D8.A R11.1
NetD10_A: D10.A R18.1
NetD12_A: D12.A R25.1
NetD34_A: D34.A R95.1
NetQ1_G: Q1.G R13.2
NetQ2_G: Q2.G R20.2
NetQ3_G: Q3.G R27.2
NetR5_1: R5.1 TP12.1 ; port AIR Power (ISO)
NetR5_2: R5.2 R6.2 U8.3(E)
NetR7_1: R7.1 U8.2(K)
NetR9_1: R9.1 R12.2 U10.12(C)
NetR13_1: R13.1 R15.2 TP14.1 U9.7(VOA)
NetR16_1: R16.1 R17.2
NetR17_1: R17.1 U11.1
NetR19_1: R19.1 R21.2
NetR19_2: R19.2 U11.4
NetR23_1: R23.1 R26.2 U10.10(C)
NetR27_1: R27.1 R29.2 TP17.1 U9.6(VOA)

### Layout directives
net class HV: (no net found under the mark)
net class VEHICLE: 0V, 5V, AIR Power, GLV-
net class MICROCONTROLLER: 0V (ISO), 5V (ISO), PCH_OC

### Notes on the sheet
- 18mW: GATE DRIVER x2
- 0.6W: REED SWITCH
- ISOLATED
- VEHICLE
- HIGH VOLTAGE
- Title
- Size:
- Date:
- A3
- Number:
- Time:
- Revision:
- Sheet
- of
- File:

### Library data of the parts
C24 C25 = GCM21BR71H104KA37L: as C2 on sheet CAN; Part Number: GCM21BR71H104KA37L; Value: 100nF; Digikey Part Number: 490-6064-1-ND
C26 = GRM21BR6YA106KE43L: as C5 on sheet CAN; Part Number: GRM21BR6YA106KE43L; Value: 10uF; Digikey Part Number: 490-10514-6-ND
D6 = SML-210FTT86: Green LED Indication - Discrete 1.75V 0805 (2012 Metric); Manufacturer: ROHM Semiconductor; Part Number: SML-210FTT86; Colour: Green; Digikey Part Number: 511-1285-1-ND; Digikey Link: https://www.digikey.com/product-detail/en/rohm-semiconductor/SML-210FTT86/511-1285-1-ND/637098
D7 D9 D11 = SD560BTR: as D1 on sheet Power Supply; Part Number: SD560BTR; Digikey Part Number: 1655-1530-2-ND; Digikey Link: https://www.digikey.com/product-detail/en/smc-diode-solutions/SD560BTR/1655-1530-2-ND/6022620
D8 D10 D12 D34 = SML-211DTT86: Orange LED Indication - Discrete 1.75V 0805 (2012 Metric); Manufacturer: ROHM Semiconductor; Part Number: SML-211DTT86; Colour: Orange; Digikey Part Number: 511-1291-1-ND; Digikey Link: https://www.digikey.com/product-detail/en/rohm-semiconductor/SML-211DTT86/511-1291-1-ND/637104
Q1 Q3 = STD70N10F4: N-Channel 100V 60A (Tc) 125W (Tc) Surface Mount DPAK; Manufacturer: STMicroelectronics; Published: 24-Mar-1999; LatestRevisionDate: 29-May-2009; LatestRevisionNote: IPC-7351 Footprint Added.; PackageVersion: Sep-2000; PackageReference: SOT-343; Publisher: Altium Limited; PackageDescription: 4-Pin SOT-343 Package 1.3 mm Pitch, 2.1 mm Lead Span; Part Number: STD70N10F4; Digikey Part Number: 497-8806-2-ND; Digikey Link: https://www.digikey.com/product-detail/en/stmicroelectronics/STD70N10F4/497-8806-2-ND/2035599
Q2 = 2N7002K: 60V 380mA, NFET MOSTFET (Small Signal); Manufacturer: ON Semiconductor; Published: 24-Mar-1999; LatestRevisionDate: 29-May-2009; LatestRevisionNote: IPC-7351 Footprint Added.; PackageVersion: Sep-2000; PackageReference: SOT-343; Publisher: Altium Limited; PackageDescription: 4-Pin SOT-343 Package 1.3 mm Pitch, 2.1 mm Lead Span; Part Number: 2N7002K; Digikey Part Number: 2N7002KCT-ND; Digikey Link: https://www.digikey.com/product-detail/en/on-semiconductor/2N7002K/2N7002KCT-ND/2060375; Qty: 30
R5 R12 R26 = RC0805FR07680RL: Manufacturer: YAGEO; Tolerance: 0.01; Rated Voltage: 0.125W; Part Number: RC0805FR07680RL; Value: 680R; Material: FR-07; Digikey Part Number: 311-680CRCT-ND
R6 R9 R14 R15 R22 R23 R28 R29 = RC0805FR0720KL: Manufacturer: YAGEO; Tolerance: 0.01; Rated Voltage: 0.125W; Part Number: RC0805FR0720KL; Value: 20k; Material: FR-07; Digikey Part Number: 311-20.0KCRCT-ND
R7 R8 R10 R11 R18 R24 R25 R95 = RC0805FR071K5L: as R4 on sheet Power Supply; Part Number: RC0805FR071K5L; Value: 1.5k; Material: FR-07; Digikey Part Number: 311-1.50KCRCT-ND
R13 R20 R27 = RC0805FR0710RL: Manufacturer: YAGEO; Tolerance: 0.01; Rated Voltage: 0.125W; Part Number: RC0805FR0710RL; Value: 10R; Material: FR-07; Digikey Part Number: 311-10.0CRCT-ND
R16 R17 R19 R21 = PWR263S-35-1001J: Manufacturer: Bournes Inc; Tolerance: 0.05; Rated Voltage: 35W; Part Number: PWR263S-35-1001J; Value: 1k; Digikey Part Number: PWR263S-35-1001J-ND
TP11-TP17 TP45 TP? = SMD Test Point Small: as TP1 on sheet CAN; Part Number: SMD Test Point Small; Angle: 0
U8 = LTV-817S-TA1: 35V 50ma Optocoupler (VF=1.2V); Manufacturer: Lite-On Inc; Part Number: LTV-817S-TA1; Digikey Part Number: 160-1893-2-ND; Digikey Link: https://www.digikey.com/product-detail/en/lite-on-inc/LTV-817S-TA1/160-1893-2-ND/388451
U9 = ADUM3221ARZ: 4A Gate Driver Magnetic Coupling 2500Vrms 2 Channel 8-SOIC; Manufacturer: Analog Devices; Part Number: ADUM3221ARZ; Digikey Part Number: ADUM3221ARZ-ND; Digikey Link: https://www.digikey.com/product-detail/en/analog-devices-inc/ADUM3221ARZ/ADUM3221ARZ-ND/2616333
U10 = LTV-847S-TA1: Optoisolator Transistor Output 5000Vrms 4 Channel 16-SMD; Manufacturer: Lite-On Inc; Part Number: LTV-847S-TA1; Digikey Part Number: 160-1371-5-ND; Digikey Link: https://www.digikey.com.au/product-detail/en/lite-on-inc/LTV-847S/160-1371-5-ND/385841
U11 = 3350-1275-056: RELAY REED HV SPST 200W 3A 5V (NO); Manufacturer: Comus International; Part Number: 3350-1275-056; Digikey Part Number: 1835-1036-ND; Digikey Link: https://www.digikey.com.au/product-detail/en/comus-international/3350-1275-056/1835-1036-ND/7515918

## Sheet Microcontroller.SchDoc
size A3
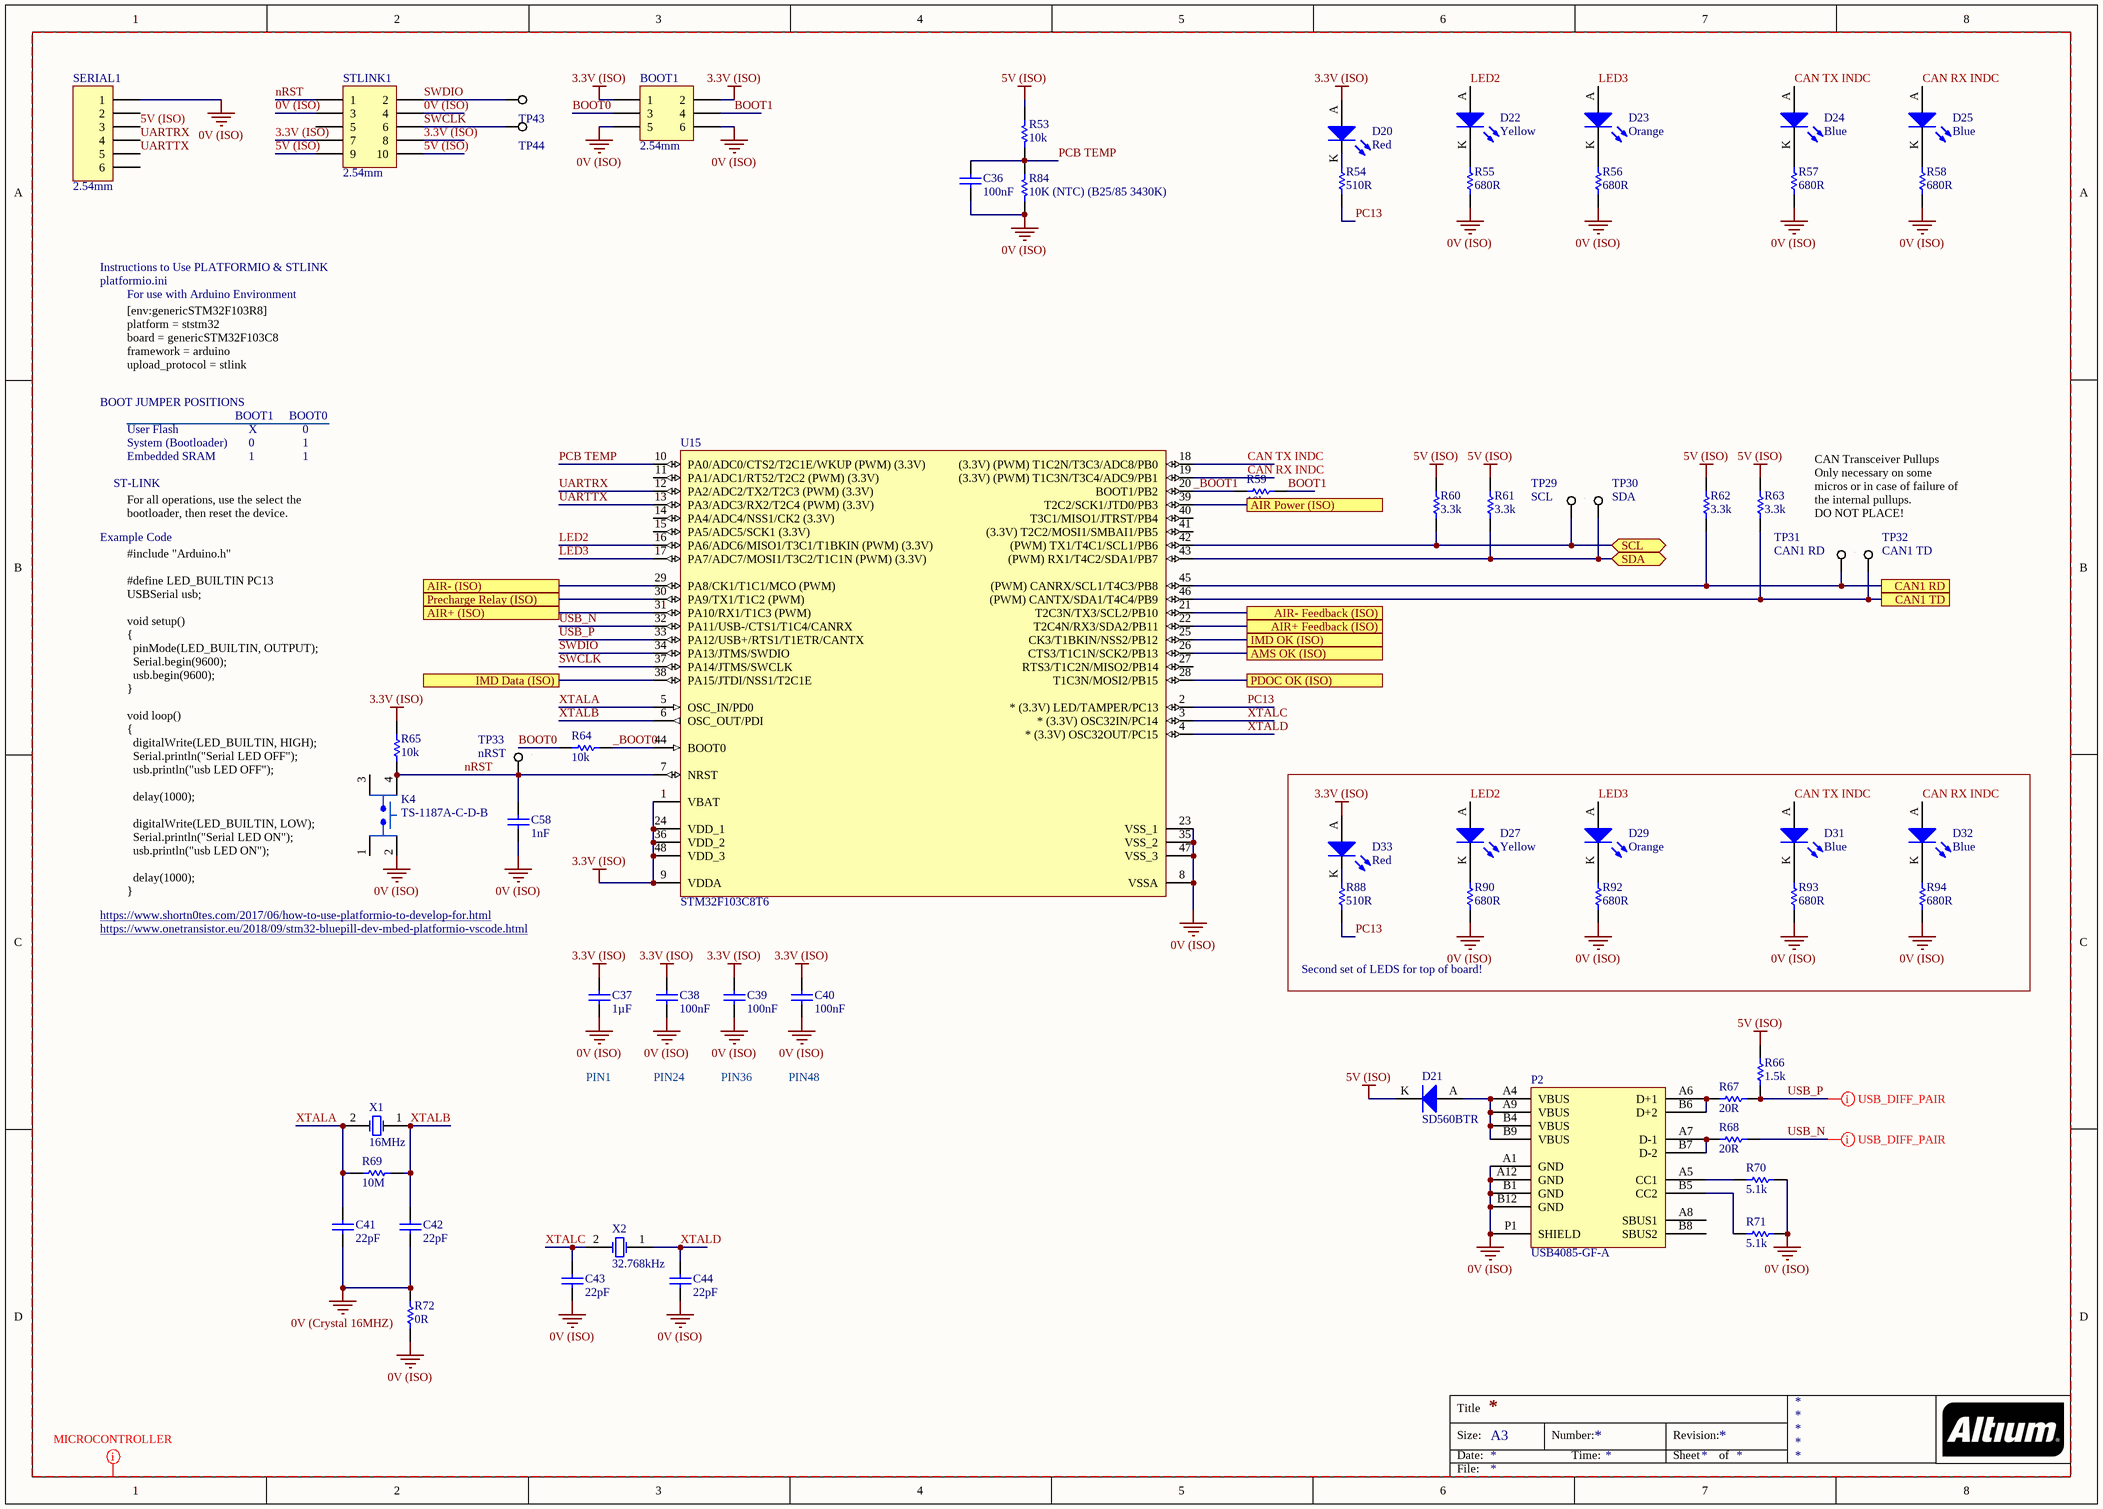
[diagram p4: Microcontroller.SchDoc]

### Parts
BOOT1  2.54mm  [TH 2.54mm Header 2x3]
C36  100nF  [0805]
C37  1µF  [0805]
C38  100nF  [0805]
C39  100nF  [0805]
C40  100nF  [0805]
C41  22pF  [0805]
C42  22pF  [0805]
C43  22pF  [0805]
C44  22pF  [0805]
C58  1nF  [0805]
D20  Red  [0805 LED]
D21  SD560BTR  [SMB Diode]
D22  Yellow  [0805 LED]
D23  Orange  [0805 LED]
D24  Blue  [0805 LED]
D25  Blue  [0805 LED]
D27  Yellow  [0805 LED]
D29  Orange  [0805 LED]
D31  Blue  [0805 LED]
D32  Blue  [0805 LED]
D33  Red  [0805 LED]
K4  TS-1187A-C-D-B  [XKB SW-4.5]
P2  USB4085-GF-A  [USB4085-GF-A]
R53  10k  [0805]
R54  510R  [0805]
R55  680R  [0805]
R56  680R  [0805]
R57  680R  [0805]
R58  680R  [0805]
R59  10k  [0805]
R60  3.3k  [0805]
R61  3.3k  [0805]
R62  3.3k  [0805]
R63  3.3k  [0805]
R64  10k  [0805]
R65  10k  [0805]
R66  1.5k  [0805]
R67  20R  [0805]
R68  20R  [0805]
R69  10M  [0805]
R70  5.1k  [0805]
R71  5.1k  [0805]
R72  0R  [0805]
R84  10K (NTC) (B25/85 3430K)  [0805]
R88  510R  [0805]
R90  680R  [0805]
R92  680R  [0805]
R93  680R  [0805]
R94  680R  [0805]
SERIAL1  2.54mm  [TH 2.54mm Header 1x6]
STLINK1  2.54mm  [TH 2.54mm Header 2x5]
TP29  SCL  [SMD Test Point 1mm]
TP30  SDA  [SMD Test Point 1mm]
TP31  CAN1 RD  [SMD Test Point 1mm]
TP32  CAN1 TD  [SMD Test Point 1mm]
TP33  nRST  [SMD Test Point 1mm]
TP43  0mm  [SMD Test Point 1mm]  (value not drawn)
TP44  0mm  [SMD Test Point 1mm]  (value not drawn)
U15  STM32F103C8T6  [STM 48-LQFP]
X1  16MHz  [Abracon HC-49/US]
X2  32.768kHz  [EPSON 2-SMD]

### Blocks framed on the sheet
Second set of LEDS for top of board!: D27 D29 D31-D33 R88 R90 R92-R94

### Ports
AIR Power (ISO), AIR+ (ISO), AIR+ Feedback (ISO), AIR- (ISO), AIR- Feedback (ISO), AMS OK (ISO), CAN1 RD, CAN1 TD, IMD Data (ISO), IMD OK (ISO), PDOC OK (ISO), Precharge Relay (ISO), SCL (bidir), SDA (bidir)

### Nets
0V (Crystal 16MHZ): C41.1 C42.1 R72.2
0V (ISO): BOOT1.5 BOOT1.6 C36.1 C37.1 C38.1 C39.1 C40.1 C43.1 C44.1 C58.1 K4.2(VDD) P2.A1(GND) P2.A12(GND) P2.B1(GND) P2.B12(GND) P2.P1(SHIELD) R55.1 R56.1 R57.1 R58.1 R70.2 R71.2 R72.1 R84.1 R90.1 R92.1 R93.1 R94.1 SERIAL1.1 STLINK1.3 STLINK1.4 U15.8(VSSA) U15.23(VSS_1) U15.35(VSS_2) U15.47(VSS_3)
3.3V (ISO): BOOT1.1 BOOT1.2 C37.2 C38.2 C39.2 C40.2 D20.A D33.A R65.2 STLINK1.7 STLINK1.8 U15.1(VBAT) U15.9(VDDA) U15.24(VDD_1) U15.36(VDD_2) U15.48(VDD_3)
5V (ISO): D21.K R53.2 R60.2 R61.2 R62.2 R63.2 R66.2 SERIAL1.3 STLINK1.9 STLINK1.10
_BOOT0: R64.2 U15.44(BOOT0)
_BOOT1: R59.1 U15.20(BOOT1/PB2)
AIR+ (ISO): U15.31(PA10/RX1/T1C3_(PWM)) ; port AIR+ (ISO)
AIR+ Feedback (ISO): U15.22(T2C4N/RX3/SDA2/PB11) ; port AIR+ Feedback (ISO)
AIR- (ISO): U15.29(PA8/CK1/T1C1/MCO_(PWM)) ; port AIR- (ISO)
AIR- Feedback (ISO): U15.21(T2C3N/TX3/SCL2/PB10) ; port AIR- Feedback (ISO)
AMS OK (ISO): U15.26(CTS3/T1C1N/SCK2/PB13) ; port AMS OK (ISO)
BOOT0: BOOT1.3 R64.1
BOOT1: BOOT1.4 R59.2
CAN RX: R62.1 TP31.1 U15.45((PWM)_CANRX/SCL1/T4C3/PB8) ; port CAN1 RD
CAN RX INDC: D25.A D32.A U15.19((3.3V)_(PWM)_T1C3N/T3C4/ADC9/PB1)
CAN TX: R63.1 TP32.1 U15.46((PWM)_CANTX/SDA1/T4C4/PB9) ; port CAN1 TD
CAN TX INDC: D24.A D31.A U15.18((3.3V)_(PWM)_T1C2N/T3C3/ADC8/PB0)
IMD Data (ISO): U15.38(PA15/JTDI/NSS1/T2C1E) ; port IMD Data (ISO)
IMD OK (ISO): U15.25(CK3/T1BKIN/NSS2/PB12) ; port IMD OK (ISO)
LED2: D22.A D27.A U15.16(PA6/ADC6/MISO1/T3C1/T1BKIN_(PWM)_(3.3V))
LED3: D23.A D29.A U15.17(PA7/ADC7/MOSI1/T3C2/T1C1N_(PWM)_(3.3V))
nRST: C58.2 K4.4(VDD) R65.1 STLINK1.1 TP33.1 U15.7(NRST)
PC13: R54.1 R88.1 U15.2(*_(3.3V)_LED/TAMPER/PC13)
PCB TEMP: C36.2 R53.1 R84.2 U15.10(PA0/ADC0/CTS2/T2C1E/WKUP_(PWM)_(3.3V))
PDOC OK (ISO): U15.28(T1C3N/MOSI2/PB15) ; port PDOC OK (ISO)
Precharge Relay (ISO): U15.30(PA9/TX1/T1C2_(PWM)) ; port Precharge Relay (ISO)
SCL: R60.1 TP29.1 U15.42((PWM)_TX1/T4C1/SCL1/PB6) ; port SCL
SDA: R61.1 TP30.1 U15.43((PWM)_RX1/T4C2/SDA1/PB7) ; port SDA
SWCLK: STLINK1.6 TP44.1 U15.37(PA14/JTMS/SWCLK)
SWDIO: STLINK1.2 TP43.1 U15.34(PA13/JTMS/SWDIO)
UARTRX: SERIAL1.4 U15.12(PA2/ADC2/TX2/T2C3_(PWM)_(3.3V))
UARTTX: SERIAL1.5 U15.13(PA3/ADC3/RX2/T2C4_(PWM)_(3.3V))
USB_N: R68.2 U15.32(PA11/USB-/CTS1/T1C4/CANRX)
USB_P: R66.1 R67.2 U15.33(PA12/USB+/RTS1/T1ETR/CANTX)
XTALA: C41.2 R69.2 U15.5(OSC_IN/PD0) X1.2(OSC2)
XTALB: C42.2 R69.1 U15.6(OSC_OUT/PDI) X1.1(OSC1)
XTALC: C43.2 U15.3(*_(3.3V)_OSC32IN/PC14) X2.2(OSC2)
XTALD: C44.2 U15.4(*_(3.3V)_OSC32OUT/PC15) X2.1(OSC1)
NetD20_K: D20.K R54.2
NetD21_A: D21.A P2.A4(VBUS) P2.A9(VBUS) P2.B4(VBUS) P2.B9(VBUS)
NetD22_K: D22.K R55.2
NetD23_K: D23.K R56.2
NetD24_K: D24.K R57.2
NetD25_K: D25.K R58.2
NetD27_K: D27.K R90.2
NetD29_K: D29.K R92.2
NetD31_K: D31.K R93.2
NetD32_K: D32.K R94.2
NetD33_K: D33.K R88.2
NetP2_A5: P2.A5(CC1) R70.1
NetP2_A6: P2.A6(D+1) P2.B6(D+2) R67.1
NetP2_A7: P2.A7(D-1) P2.B7(D-2) R68.1
NetP2_B5: P2.B5(CC2) R71.1
NetR5_1: U15.39(T2C2/SCK1/JTD0/PB3) ; port AIR Power (ISO)

Not connected (* = marked no-connect by the designer): K4 1(VDD) 3(VDD); P2 A8(SBUS1) B8(SBUS2); SERIAL1 2 6; STLINK1 5; U15 11(PA1/ADC1/RT52/T2C2_(PWM)_(3.3V)) 14(PA4/ADC4/NSS1/CK2_(3.3V)) 15(PA5/ADC5/SCK1_(3.3V)) 27(RTS3/T1C2N/MISO2/PB14) 40(T3C1/MISO1/JTRST/PB4) 41((3.3V)_T2C2/MOSI1/SMBAI1/PB5)

### Layout directives
net class MICROCONTROLLER: 0V (Crystal 16MHZ), 0V (ISO), 3.3V (ISO), 5V (ISO), _BOOT0, _BOOT1, BOOT0, BOOT1, CAN RX INDC, CAN TX INDC, LED2, LED3, nRST, PC13, PCB TEMP, SWCLK, SWDIO, UARTRX, UARTTX, USB_N, USB_P, XTALA, XTALB, XTALC, XTALD
differential pair; differential pair class USB_DIFF_PAIR: USB_N, USB_P

### Notes on the sheet
- Instructions to Use PLATFORMIO & STLINK
- platformio.ini
- For use with Arduino Environment
- BOOT JUMPER POSITIONS
- [env:genericSTM32F103R8]
  platform = ststm32
  board = genericSTM32F103C8
  framework = arduino
  upload_protocol = stlink
- User Flash
- System (Bootloader)
- BOOT1
- X
- 0
- BOOT0
- 1
- ST-LINK
- Embedded SRAM
- For all operations, use the select the bootloader, then reset the device.
- CAN Transceiver Pullups
  Only necessary on some micros or in case of failure of the internal pullups.
  DO NOT PLACE!
- Example Code
- https://www.shortn0tes.com/2017/06/how-to-use-platformio-to-develop-for.html
- (near K4) #include "Arduino.h"
  #define LED_BUILTIN PC13
  USBSerial usb;
  void setup()
  {
  pinMode(LED_BUILTIN, OUTPUT);
  Serial.begin(9600);
  usb.begin(9600);
  }
  void loop()
  {
  digitalWrite(LED_BUILTIN, HIGH);
  Serial.println("Serial LED OFF");
  usb.println("usb LED OFF");
  delay(1000);
  digitalWrite(LED_BUILTIN, LOW);
  Serial.println("Serial LED ON");
  usb.println("usb LED ON");
  delay(1000);
  }
- https://www.onetransistor.eu/2018/09/stm32-bluepill-dev-mbed-platformio-vscode.html
- PIN1
- PIN24
- PIN36
- PIN48
- Title
- Size:
- Date:
- A3
- Number:
- Time:
- Revision:
- Sheet
- of
- File:

### Library data of the parts
BOOT1 = TH 2.54mm Header 2x3: Positions: 6; Angle: 0; Flange: No; Contact: NA; Part Number: TH 2.54mm Header 2x3; Pitch: 2.54mm; Row Spacing: 2.54mm
C36 = GCM21BR71E104KA37L: Manufacturer: muRata; Tolerance: 10%; Material: X7R; Rated Voltage: 25V; Part Number: GCM21BR71E104KA37L; Value: 100nF; Digikey Part Number: DO NOT USE FOR NEW DESIGNS
C37 = GCM21BR71H105KA03L: Manufacturer: muRata; Tolerance: ±10%; Material: X7R; Rated Voltage: 50V; Part Number: GCM21BR71H105KA03L; Value: 1µF; Digikey Part Number: 490-10675-1-ND
C38-C40 = GCM21BR71H104KA37L: as C2 on sheet CAN; Part Number: GCM21BR71H104KA37L; Value: 100nF; Digikey Part Number: 490-6064-1-ND
C41-C44 = GRM21A5C2E220JW01D: as C9 on sheet CAN; Part Number: GRM21A5C2E220JW01D; Value: 22pF; Digikey Part Number: 490-5534-1-ND
C58 = GCM21BR71H102KA37L: Manufacturer: muRata; Tolerance: 10%; Material: X7R; Rated Voltage: 50V; Part Number: GCM21BR71H102KA37L; Value: 1nF; Digikey Part Number: DO NOT USE FOR NEW DESIGNS
D20 D33 = SML-210LTT86: as D3 on sheet Power Supply; Part Number: SML-210LTT86; Colour: Red; Digikey Part Number: 511-1286-1-ND; Digikey Link: https://www.digikey.com/product-detail/en/rohm-semiconductor/SML-210LTT86/511-1286-1-ND/637099
D21 = SD560BTR: as D1 on sheet Power Supply; Part Number: SD560BTR; Digikey Part Number: 1655-1530-2-ND; Digikey Link: https://www.digikey.com/product-detail/en/smc-diode-solutions/SD560BTR/1655-1530-2-ND/6022620
D22 D27 = SML-211YTT86: Yellow LED Indication - Discrete 1.75V 0805 (2012 Metric); Manufacturer: ROHM Semiconductor; Part Number: SML-211YTT86; Colour: Yellow; Digikey Part Number: 511-1293-1-ND; Digikey Link: https://www.digikey.com/product-detail/en/rohm-semiconductor/SML-211YTT86/511-1293-1-ND/637106
D23 D29 = SML-211DTT86: as D8 on sheet Precharge; Part Number: SML-211DTT86; Colour: Orange; Digikey Part Number: 511-1291-1-ND; Digikey Link: https://www.digikey.com/product-detail/en/rohm-semiconductor/SML-211DTT86/511-1291-1-ND/637104
D24 D25 D31 D32 = SML-MN2BCTT86C: LED BLUE CLEAR 2012 SMD; Manufacturer: ROHM Semiconductor; Part Number: SML-MN2BCTT86C; Colour: Blue; Digikey Part Number: 846-1207-1-ND; Digikey Link: https://www.digikey.com/product-detail/en/rohm-semiconductor/SMLMN2BCTT86C/846-1207-1-ND/6057239
K4 = TS-1187A-C-D-B: TACTILE SWITCHES SPST 5.10MM X 5.10MM 0.80MM SMD ROHS; Manufacturer: XKB Enerprise; Part Number: TS-1187A-C-D-B; Link: https://jlcpcb.com/client/index.html#/parts/componentSearch?searchTxt=usb
P2 = USB4085-GF-A: USB - C (Type - C) USB 2.0 Receptacle Connector 16 Position Through Hole, Right Angle; Angle: 90; Part Number: USB4085-GF-A; Digikey Part Number: 2073-USB4085-GF-ACT-ND; Digikey Link: https://www.digikey.ee/product-detail/en/gct/USB4085-GF-A/2073-USB4085-GF-ACT-ND/9859733
R53 R59 R64 R65 = RC0805FR0710KL: Manufacturer: YAGEO; Tolerance: 0.01; Rated Voltage: 0.125W; Part Number: RC0805FR0710KL; Value: 10k; Material: FR-07; Digikey Part Number: 311-10.0KCRCT-ND
R54 R88 = RC0805FR07510RL: Manufacturer: YAGEO; Tolerance: 0.01; Rated Voltage: 0.125W; Part Number: RC0805FR07510RL; Value: 510R; Material: FR-07; Digikey Part Number: 311-510CRCT-ND
R55-R58 R90 R92-R94 = RC0805FR07680RL: as R5 on sheet Precharge; Part Number: RC0805FR07680RL; Value: 680R; Material: FR-07; Digikey Part Number: 311-680CRCT-ND
R60-R63 = RC0805FR073K3L: Manufacturer: YAGEO; Tolerance: 0.01; Rated Voltage: 0.125W; Part Number: RC0805FR073K3L; Value: 3.3k; Material: FR-07; Digikey Part Number: 311-3.30KCRCT-ND
R66 = RC0805FR071K5L: as R4 on sheet Power Supply; Part Number: RC0805FR071K5L; Value: 1.5k; Material: FR-07; Digikey Part Number: 311-1.50KCRCT-ND
R67 R68 = RC0805FR0720RL: Manufacturer: YAGEO; Tolerance: 0.01; Rated Voltage: 0.125W; Part Number: RC0805FR0720RL; Value: 20R; Material: FR-07; Digikey Part Number: 311-20.0CRCT-ND
R69 = RC0805FR0710ML: Manufacturer: YAGEO; Tolerance: 0.01; Rated Voltage: 0.125W; Part Number: RC0805FR0710ML; Value: 10M; Material: FR-07; Digikey Part Number: 311-10.0MCRCT-ND
R70 R71 = RC0805FR075K1L: Manufacturer: YAGEO; Tolerance: 0.01; Rated Voltage: 0.125W; Part Number: RC0805FR075K1L; Value: 5.1k; Material: FR-07; Digikey Part Number: 311-5.10KCRCT-ND
R72 = RC0805FR070RL: as R85 on sheet Top Level; Part Number: RC0805FR070RL; Value: 0R; Material: FR-07; Digikey Part Number: 311-0.0CRCT-ND
R84 = NTCS0805E3103FLT: Manufacturer: Vishay Beyschlag; Tolerance: 0.01; Rated Voltage: 210mW; Part Number: NTCS0805E3103FLT; Value: 10K (NTC) (B25/85 3430K); Digikey Part Number: BC2733CT-ND
SERIAL1 = TH 2.54mm Header 1x6: Positions: 6; Angle: 0; Flange: No; Contact: NA; Part Number: TH 2.54mm Header 1x6; Pitch: 2.54mm; Row Spacing: 2.54mm
STLINK1 = TH 2.54mm Header 2x5: Positions: 10; Angle: 0; Flange: No; Contact: NA; Part Number: TH 2.54mm Header 2x5; Pitch: 2.54mm; Row Spacing: 2.54mm
TP29-TP33 = SMD Test Point Small: as TP1 on sheet CAN; Part Number: SMD Test Point Small; Angle: 0
TP43 TP44 = SMD Test Point Small: Positions: 1; Row Spacing: 0; Flange: No; Contact: NA; Part Number: SMD Test Point Small; Pitch: 0mm; Angle: 0
U15 = STM32F103C8T6: ARM® Cortex®-M3 STM32F1 Microcontroller IC 32-Bit 72MHz 64KB (64K x 8) FLASH; Manufacturer: STMicroelectronics; Part Number: STM32F103C8T6; Digikey Part Number: 497-6063-ND; Digikey Link: https://www.digikey.com/product-detail/en/stmicroelectronics/STM32F103C8T6/497-6063-ND/1646338
X1 = ABLS-16.000MHZ-B4-T: Manufacturer: Abracon LLC; Load Capacitance: 18pF; ESR: 40R; Part Number: ABLS-16.000MHZ-B4-T; Digikey Part Number: 535-10226-1-ND; Digikey Link: https://www.digikey.com/product-detail/en/abracon-llc/ABLS-16.000MHZ-B4-T/535-10226-1-ND/2184261; Value: 16MHz
X2 = FC-135 32.7680KA-A5: Manufacturer: EPSON; Load Capacitance: 12.5pF; ESR: 70k; Part Number: FC-135 32.7680KA-A5; Value: 32.768kHz; Digikey Part Number: SER4103TR-ND; Digikey Link: https://www.digikey.com/product-detail/en/epson/FC-135-32.7680KA-A5/SER4103TR-ND/5259895

## Sheet Safety Loops.SchDoc
size A3
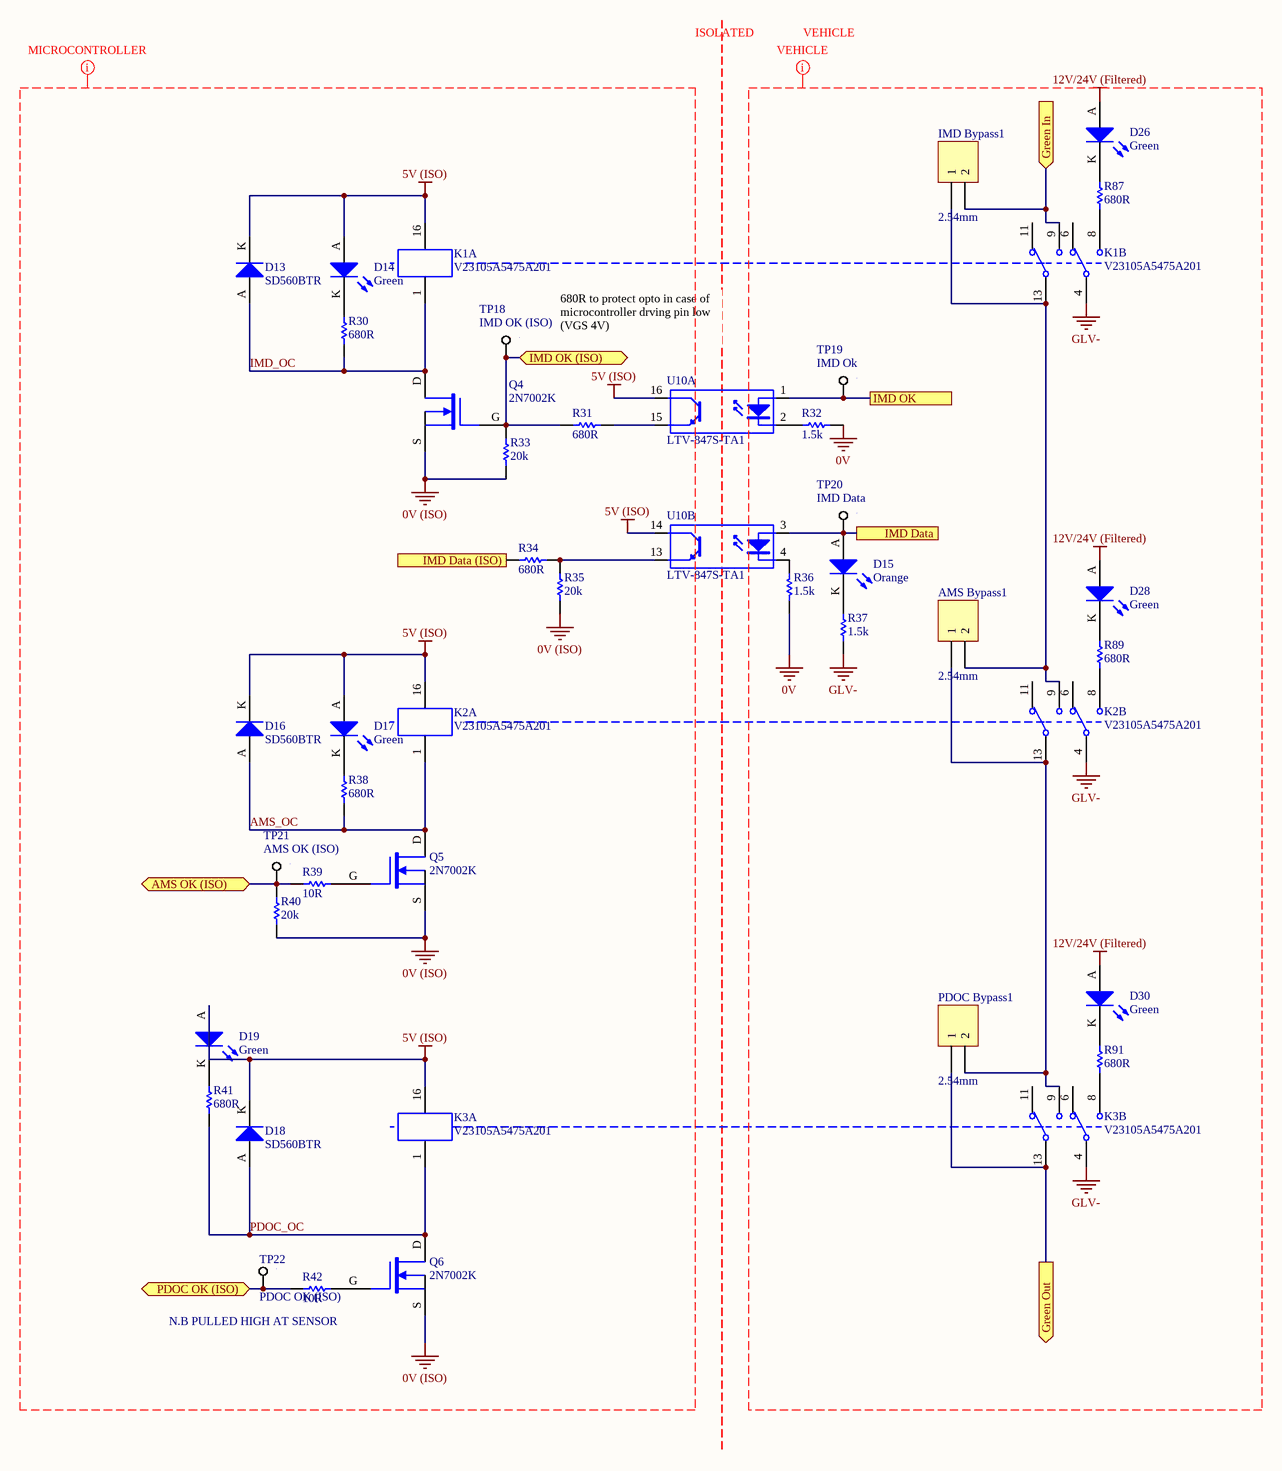
[diagram p5: Safety Loops.SchDoc]

### Parts
AMS_Bypass1  2.54mm  [TH 2.54mm Header 1x2]
D13  SD560BTR  [SMB Diode]
D14  Green  [0805 LED]
D15  Orange  [0805 LED]
D16  SD560BTR  [SMB Diode]
D17  Green  [0805 LED]
D18  SD560BTR  [SMB Diode]
D19  Green  [0805 LED]
D26  Green  [0805 LED]
D28  Green  [0805 LED]
D30  Green  [0805 LED]
IMD_Bypass1  2.54mm  [TH 2.54mm Header 1x2]
K1  V23105A5475A201  [TI 2-DIL]  (parts A,B of 2)
K2  V23105A5475A201  [TI 2-DIL]  (parts A,B of 2)
K3  V23105A5475A201  [TI 2-DIL]  (parts A,B of 2)
PDOC_Bypass1  2.54mm  [TH 2.54mm Header 1x2]
Q4  2N7002K  [ON SOT-23 MOSFET]
Q5  2N7002K  [ON SOT-23 MOSFET]
Q6  2N7002K  [ON SOT-23 MOSFET]
R30  680R  [0805]
R31  680R  [0805]
R32  1.5k  [0805]
R33  20k  [0805]
R34  680R  [0805]
R35  20k  [0805]
R36  1.5k  [0805]
R37  1.5k  [0805]
R38  680R  [0805]
R39  10R  [0805]
R40  20k  [0805]
R41  680R  [0805]
R42  10R  [0805]
R87  680R  [0805]
R89  680R  [0805]
R91  680R  [0805]
TP18  IMD OK (ISO)  [SMD Test Point 1mm]
TP19  IMD Ok  [SMD Test Point 1mm]
TP20  IMD Data  [SMD Test Point 1mm]
TP21  AMS OK (ISO)  [SMD Test Point 1mm]
TP22  PDOC OK (ISO)  [SMD Test Point 1mm]
U10  LTV-847S-TA1  [ON 16-SMD]  (parts A,B of 4)

### Ports
AMS OK (ISO) (bidir), Green In (in), Green Out (out), IMD Data, IMD Data (ISO), IMD OK, IMD OK (ISO) (bidir), PDOC OK (ISO) (bidir)

### Nets
0V: R32.1 R36.2
0V (ISO): Q4.S Q5.S Q6.S R33.1 R35.1 R40.1
5V (ISO): D13.K D14.A D16.K D17.A D18.K D19.A K1.16 K2.16 K3.16 U10.14(C) U10.16(C)
12V/24V (Filtered): D26.A D28.A D30.A
GLV-: K1.4 K2.4 K3.4 R37.2
AMS OK (ISO): R39.1 R40.2 TP21.1 ; port AMS OK (ISO)
AMS_OC: D16.A K2.1 Q5.D R38.1
Green In: IMD_Bypass1.2 K1.9 ; port Green In
Green Out: K3.13 PDOC_Bypass1.1 ; port Green Out
IMD Data: D15.A TP20.1 U10.3(A) ; port IMD Data
IMD Data (ISO): R34.1 ; port IMD Data (ISO)
IMD OK: TP19.1 U10.1(A) ; port IMD OK
IMD OK (ISO): Q4.G R31.1 R33.2 TP18.1 ; port IMD OK (ISO)
IMD_OC: D13.A K1.1 Q4.D R30.1
PDOC OK (ISO): R42.1 TP22.1 ; port PDOC OK (ISO)
PDOC_OC: D18.A K3.1 Q6.D R41.1
NetAMS_Bypass1_1: AMS_Bypass1.1 K2.13 K3.9 PDOC_Bypass1.2
NetAMS_Bypass1_2: AMS_Bypass1.2 IMD_Bypass1.1 K1.13 K2.9
NetD14_K: D14.K R30.2
NetD15_K: D15.K R37.1
NetD17_K: D17.K R38.2
NetD19_K: D19.K R41.2
NetD26_K: D26.K R87.2
NetD28_K: D28.K R89.2
NetD30_K: D30.K R91.2
NetK1_8: K1.8 R87.1
NetK2_8: K2.8 R89.1
NetK3_8: K3.8 R91.1
NetQ5_G: Q5.G R39.2
NetQ6_G: Q6.G R42.2
NetR31_2: R31.2 U10.15(E)
NetR32_2: R32.2 U10.2(K)
NetR34_2: R34.2 R35.2 U10.13(E)
NetR36_1: R36.1 U10.4(K)

Not connected (* = marked no-connect by the designer): K1 6 11; K2 6 11; K3 6 11

### Layout directives
net class MICROCONTROLLER: 0V (ISO), 5V (ISO), AMS_OC, IMD_OC, PDOC_OC
net class VEHICLE: 0V, 12V/24V (Filtered), GLV-

### Notes on the sheet
- ISOLATED
- VEHICLE
- 680R to protect opto in case of microcontroller drving pin low (VGS 4V)
- N.B PULLED HIGH AT SENSOR
- Title
- Size:
- Date:
- A3
- Number:
- Time:
- Revision:
- Sheet
- of
- File:

### Library data of the parts
AMS_Bypass1 IMD_Bypass1 PDOC_Bypass1 = TH 2.54mm Header 1x2: Positions: 2; Angle: 0; Flange: No; Contact: NA; Part Number: TH 2.54mm Header 1x2; Pitch: 2.54mm; Row Spacing: 2.54mm
D13 D16 D18 = SD560BTR: as D1 on sheet Power Supply; Part Number: SD560BTR; Digikey Part Number: 1655-1530-2-ND; Digikey Link: https://www.digikey.com/product-detail/en/smc-diode-solutions/SD560BTR/1655-1530-2-ND/6022620
D14 D17 D19 D26 D28 D30 = SML-210FTT86: as D6 on sheet Precharge; Part Number: SML-210FTT86; Colour: Green; Digikey Part Number: 511-1285-1-ND; Digikey Link: https://www.digikey.com/product-detail/en/rohm-semiconductor/SML-210FTT86/511-1285-1-ND/637098
D15 = SML-211DTT86: as D8 on sheet Precharge; Part Number: SML-211DTT86; Colour: Orange; Digikey Part Number: 511-1291-1-ND; Digikey Link: https://www.digikey.com/product-detail/en/rohm-semiconductor/SML-211DTT86/511-1291-1-ND/637104
K1-K3 = V23105A5475A201: 5V DPDT Relay 3A 220VDC; Manufacturer: Axicom; Part Number: V23105A5475A201; Digikey Part Number: PB383-ND; Digikey Link: https://www.digikey.com/products/en?mpart=V23105A5001A201&v=41
Q4-Q6 = 2N7002K: as Q2 on sheet Precharge; Published: 24-Mar-1999; LatestRevisionDate: 29-May-2009; LatestRevisionNote: IPC-7351 Footprint Added.; PackageVersion: Sep-2000; PackageReference: SOT-343; Publisher: Altium Limited; PackageDescription: 4-Pin SOT-343 Package 1.3 mm Pitch, 2.1 mm Lead Span; Part Number: 2N7002K; Digikey Part Number: 2N7002KCT-ND; Digikey Link: https://www.digikey.com/product-detail/en/on-semiconductor/2N7002K/2N7002KCT-ND/2060375; Qty: 30
R30 R31 R34 R38 R41 R87 R89 R91 = RC0805FR07680RL: as R5 on sheet Precharge; Part Number: RC0805FR07680RL; Value: 680R; Material: FR-07; Digikey Part Number: 311-680CRCT-ND
R32 R36 R37 = RC0805FR071K5L: as R4 on sheet Power Supply; Part Number: RC0805FR071K5L; Value: 1.5k; Material: FR-07; Digikey Part Number: 311-1.50KCRCT-ND
R33 R35 R40 = RC0805FR0720KL: as R6 on sheet Precharge; Part Number: RC0805FR0720KL; Value: 20k; Material: FR-07; Digikey Part Number: 311-20.0KCRCT-ND
R39 R42 = RC0805FR0710RL: as R13 on sheet Precharge; Part Number: RC0805FR0710RL; Value: 10R; Material: FR-07; Digikey Part Number: 311-10.0CRCT-ND
TP18-TP22 = SMD Test Point Small: as TP1 on sheet CAN; Part Number: SMD Test Point Small; Angle: 0
U10 = LTV-847S-TA1: as U10 on sheet Precharge; Part Number: LTV-847S-TA1; Digikey Part Number: 160-1371-5-ND; Digikey Link: https://www.digikey.com.au/product-detail/en/lite-on-inc/LTV-847S/160-1371-5-ND/385841

## Nets that join several sheets
0V: Top Level (P1.2), Power Supply (8 pins), Precharge (5 pins), Safety Loops (R32.1 R36.2)
0V (ISO): CAN (9 pins), Power Supply (10 pins), Precharge (9 pins), Microcontroller (35 pins), Safety Loops (6 pins)
3.3V (ISO): CAN (C1.2 C2.2 U1.6), Power Supply (5 pins), Microcontroller (16 pins)
5V: Power Supply (C15.2 D3.A TP5.1 U4.3), Precharge (5 pins)
5V (ISO): CAN (C7.2 C8.2 U1.8), Power Supply (7 pins), Precharge (9 pins), Microcontroller (10 pins), Safety Loops (11 pins)
12V/24V (Filtered): Top Level (P1.1), Power Supply (7 pins), Safety Loops (D26.A D28.A D30.A)
AIR Power: Top Level (PRIMARY_INTERFACE1.12 PRIMARY_INTERFACE1.13 PRIMARY_INTERFACE1.17), Precharge (7 pins)
GLV-: Top Level (PRIMARY_INTERFACE1.1 PRIMARY_INTERFACE1.11 PRIMARY_INTERFACE1.16 PRIMARY_INTERFACE1.20), Power Supply (5 pins), Precharge (6 pins), Safety Loops (K1.4 K2.4 K3.4 R37.2)
AIR+: Top Level (PRIMARY_INTERFACE1.15), Precharge (D11.A D12.K Q3.D)
AIR+ (ISO): Precharge (R28.2 TP16.1 U9.3), Microcontroller (U15.31)
AIR+ Feedback (ISO): Precharge (R26.1 TP?.1), Microcontroller (U15.22)
AIR+ Feedback Out: Top Level (PRIMARY_INTERFACE1.14), Precharge (R24.1 U10.7)
AIR-: Top Level (PRIMARY_INTERFACE1.19 R85.1), Precharge (D7.A D8.K Q1.D)
AIR- (ISO): Precharge (R14.2 TP45.1 U9.2), Microcontroller (U15.29)
AIR- Feedback (ISO): Precharge (R12.1 TP13.1), Microcontroller (U15.21)
AIR- Feedback Out: Top Level (PRIMARY_INTERFACE1.18 R86.1), Precharge (R10.1 U10.5)
AMS OK (ISO): Microcontroller (U15.26), Safety Loops (R39.1 R40.2 TP21.1)
CAN RX: CAN (U1.4), Microcontroller (R62.1 TP31.1 U15.45)
CAN TX: CAN (U1.5), Microcontroller (R63.1 TP32.1 U15.46)
CAN_N: Top Level (PRIMARY_INTERFACE1.4), CAN (C10.2 CAN_TERM_R2.1 TP2.1 U2.1)
CAN_P: Top Level (PRIMARY_INTERFACE1.6), CAN (C11.2 CAN_TERM_R1.2 TP3.1 U2.2)
CANS: Top Level (PRIMARY_INTERFACE1.3), CAN (15 pins)
GLV+: Top Level (PRIMARY_INTERFACE1.2), Power Supply (F1.1 TP6.1)
Green In: Top Level (PRIMARY_INTERFACE1.7), Safety Loops (IMD_Bypass1.2 K1.9)
Green Out: Top Level (PRIMARY_INTERFACE1.8), Safety Loops (K3.13 PDOC_Bypass1.1)
HV Battery+: Top Level (HV_BATTERY+1.1 HV_BATTERY+1.2), Precharge (R21.1)
HV MC+: Top Level (HV_MC+1.1 HV_MC+1.2), Precharge (R16.2)
IMD Data: Top Level (P1.5), Safety Loops (D15.A TP20.1 U10.3)
IMD Data (ISO): Microcontroller (U15.38), Safety Loops (R34.1)
IMD OK: Top Level (P1.3), Safety Loops (TP19.1 U10.1)
IMD OK (ISO): Microcontroller (U15.25), Safety Loops (Q4.G R31.1 R33.2 TP18.1)
NetR5_1: Precharge (R5.1 TP12.1), Microcontroller (U15.39)
PDOC OK (ISO): Microcontroller (U15.28), Safety Loops (R42.1 TP22.1)
Precharge Relay (ISO): Precharge (R20.1 R22.2 TP15.1), Microcontroller (U15.30)